# EAGLE design Orange Board (EAGLE 8.4.3)

## Sheet 1 of 3
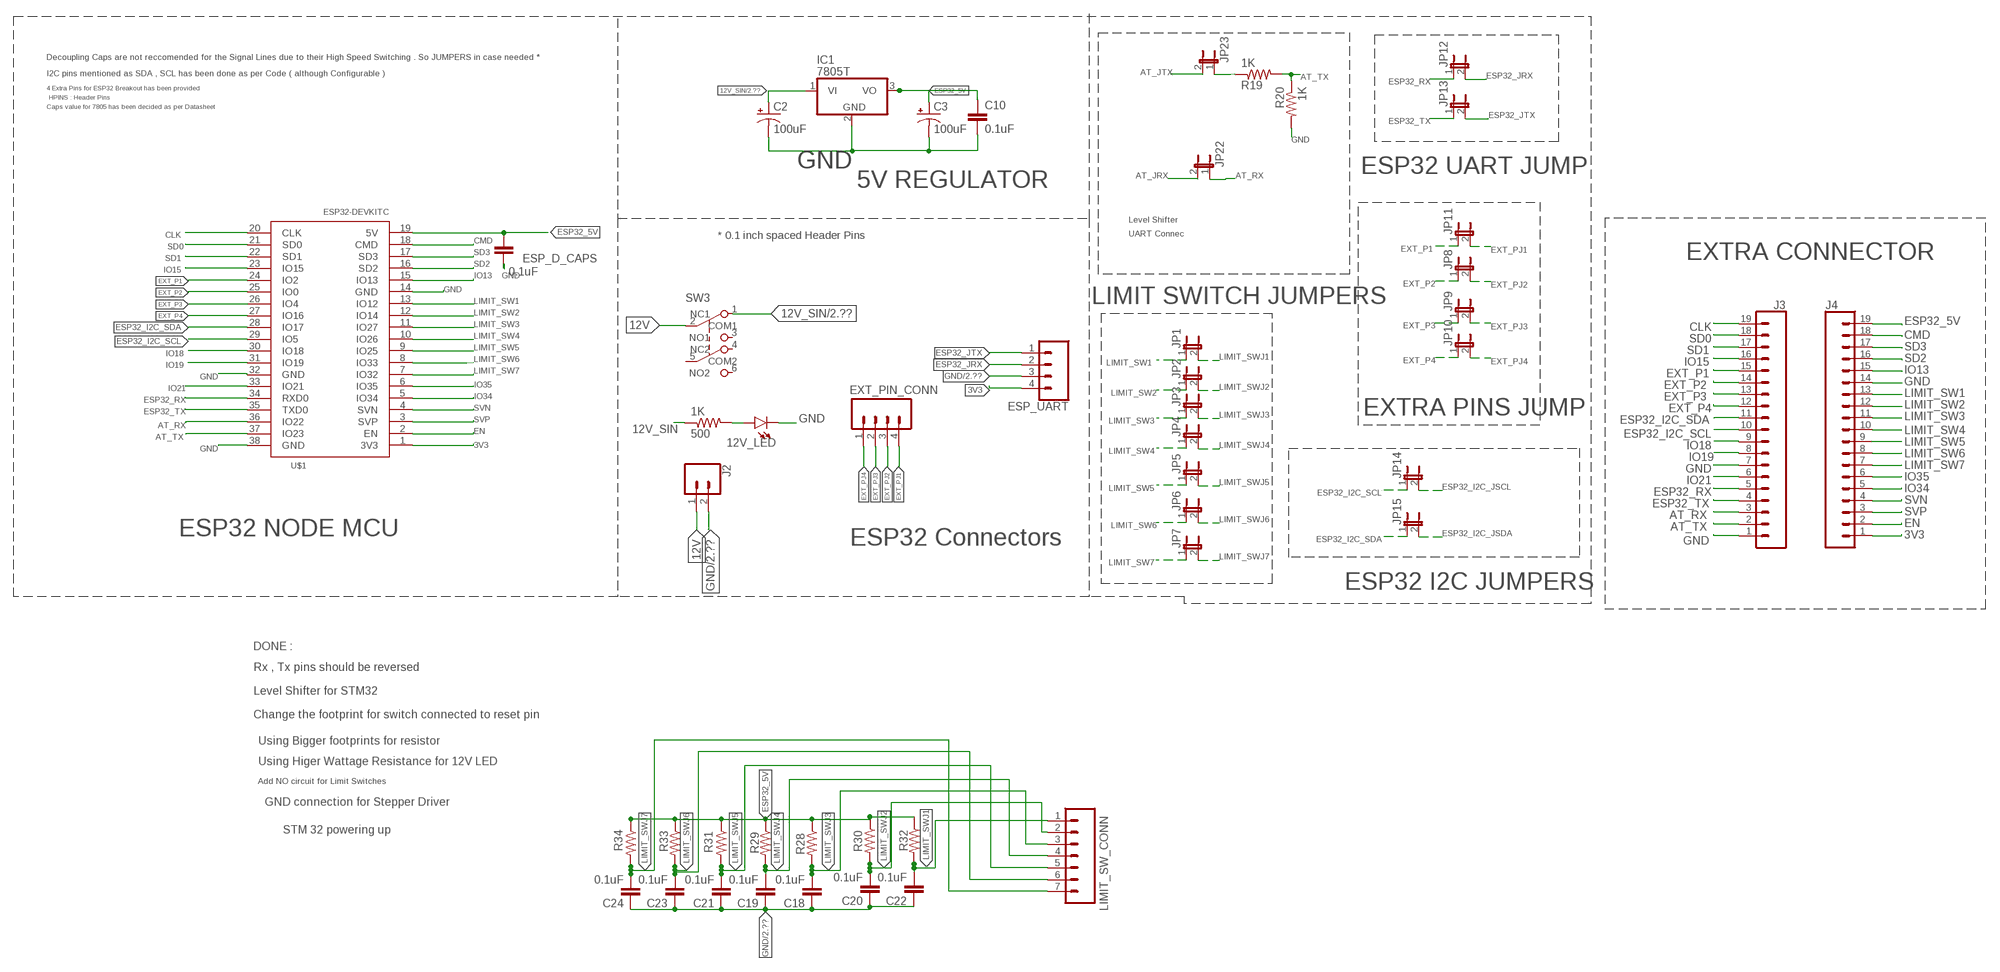
[diagram p0: schematic, sheet 1]

### Parts
12V_LED  LED-3MM-NO_SILK  [LED_3MM-NS]
500  1K  R-US_0207/15  [0207/15]
C2  100uF  100UF-POLAR-RADIAL-2.5MM-25V-20%  [CPOL-RADIAL-2.5MM-6.5MM]
C3  100uF  100UF-POLAR-RADIAL-2.5MM-25V-20%  [CPOL-RADIAL-2.5MM-6.5MM]
C10  0.1uF  0.1UF-KIT-EZ-50V-20%  [CAP-PTH-SMALL-KIT]
C18  0.1uF  0.1UF-KIT-EZ-50V-20%  [CAP-PTH-SMALL-KIT]
C19  0.1uF  0.1UF-KIT-EZ-50V-20%  [CAP-PTH-SMALL-KIT]
C20  0.1uF  0.1UF-KIT-EZ-50V-20%  [CAP-PTH-SMALL-KIT]
C21  0.1uF  0.1UF-KIT-EZ-50V-20%  [CAP-PTH-SMALL-KIT]
C22  0.1uF  0.1UF-KIT-EZ-50V-20%  [CAP-PTH-SMALL-KIT]
C23  0.1uF  0.1UF-KIT-EZ-50V-20%  [CAP-PTH-SMALL-KIT]
C24  0.1uF  0.1UF-KIT-EZ-50V-20%  [CAP-PTH-SMALL-KIT]
ESP_D_CAPS  0.1uF  0.1UF-KIT-EZ-50V-20%  [CAP-PTH-SMALL-KIT]
ESP_UART  CONN_04  [1X04]
EXT_PIN_CONN  CONN_04  [1X04]
IC1  7805T  [TO220H]
J2  CONN_025MM  [SCREWTERMINAL-5MM-2]
J3  CONN_19  [1X19]
J4  CONN_19  [1X19]
JP1  JUMPER-2PTH  [1X02]
JP2  JUMPER-2PTH  [1X02]
JP3  JUMPER-2PTH  [1X02]
JP4  JUMPER-2PTH  [1X02]
JP5  JUMPER-2PTH  [1X02]
JP6  JUMPER-2PTH  [1X02]
JP7  JUMPER-2PTH  [1X02]
JP8  JUMPER-2PTH  [1X02]
JP9  JUMPER-2PTH  [1X02]
JP10  JUMPER-2PTH  [1X02]
JP11  JUMPER-2PTH  [1X02]
JP12  JUMPER-2PTH  [1X02]
JP13  JUMPER-2PTH  [1X02]
JP14  JUMPER-2PTH  [1X02]
JP15  JUMPER-2PTH  [1X02]
JP22  JUMPER-2PTH  [1X02]
JP23  JUMPER-2PTH  [1X02]
LIMIT_SW_CONN  CONN_07  [1X07]
R19  1K  R-US_0207/10  [0207/10]
R20  1K  R-US_0207/10  [0207/10]
R28  R-US_0207/10  [0207/10]
R29  R-US_0207/10  [0207/10]
R30  R-US_0207/10  [0207/10]
R31  R-US_0207/10  [0207/10]
R32  R-US_0207/10  [0207/10]
R33  R-US_0207/10  [0207/10]
R34  R-US_0207/10  [0207/10]
SW3  SW_PUSH_DPDT  [SW_PUSH_BUTTON_MINI]
U$1  ESP32DEVKITC  [ESP32-DEVKITC]

### Nets
3V3: ESP_UART.4 J4.1 U$1.1(3V3)
12V: J2.1 SW3.2(COM1)
12V_SIN: 500.1 C2.1(+) IC1.1(VI) SW3.1(NC1) ; also sheet 2,3
AT_JRX: JP22.2 ; also sheet 3
AT_JTX: JP23.2 ; also sheet 3
AT_RX: J3.3 JP22.1 U$1.36(IO22)
AT_TX: J3.2 R19.2 R20.1 U$1.37(IO23)
CLK: J3.19 U$1.20(CLK)
CMD: J4.18 U$1.18(CMD)
EN: J4.2 U$1.2(EN)
ESP32_5V: C3.1(+) C10.1 ESP_D_CAPS.1 IC1.3(VO) J4.19 R28.1 R29.1 R30.1 R31.1 R32.1 R33.1 R34.1 U$1.19(5V)
ESP32_I2C_JSCL: JP14.2 ; also sheet 2
ESP32_I2C_JSDA: JP15.2 ; also sheet 2
ESP32_I2C_SCL: J3.10 JP14.1 U$1.29(IO5)
ESP32_I2C_SDA: J3.11 JP15.1 U$1.28(IO17)
ESP32_JRX: ESP_UART.2 JP12.2
ESP32_JTX: ESP_UART.1 JP13.2
ESP32_RX: J3.5 JP12.1 U$1.34(RXD0)
ESP32_TX: J3.4 JP13.1 U$1.35(TXD0)
EXT_P1: J3.15 JP11.1 U$1.24(IO2)
EXT_P2: J3.14 JP8.1 U$1.25(IO0)
EXT_P3: J3.13 JP9.1 U$1.26(IO4)
EXT_P4: J3.12 JP10.1 U$1.27(IO16)
EXT_PJ1: EXT_PIN_CONN.4 JP11.2
EXT_PJ2: EXT_PIN_CONN.3 JP8.2
EXT_PJ3: EXT_PIN_CONN.2 JP9.2
EXT_PJ4: EXT_PIN_CONN.1 JP10.2
GND: 12V_LED.K(C) C2.2(-) C3.2(-) C10.2 C18.1 C19.1 C20.1 C21.1 C22.1 C23.1 C24.1 ESP_D_CAPS.2 ESP_UART.3 IC1.2(GND) J2.2 J3.1 J3.7 J4.14 R20.2 U$1.14(GND) U$1.32(GND) U$1.38(GND) ; also sheet 2,3
IO13: J4.15 U$1.15(IO13)
IO15: J3.16 U$1.23(IO15)
IO18: J3.9 U$1.30(IO18)
IO19: J3.8 U$1.31(IO19)
IO21: J3.6 U$1.33(IO21)
IO34: J4.5 U$1.5(IO34)
IO35: J4.6 U$1.6(IO35)
LIMIT_SW1: J4.13 JP1.1 U$1.13(IO12)
LIMIT_SW2: J4.12 JP2.1 U$1.12(IO14)
LIMIT_SW3: J4.11 JP3.1 U$1.11(IO27)
LIMIT_SW4: J4.10 JP4.1 U$1.10(IO26)
LIMIT_SW5: J4.9 JP5.1 U$1.9(IO25)
LIMIT_SW6: J4.8 JP6.1 U$1.8(IO33)
LIMIT_SW7: J4.7 JP7.1 U$1.7(IO32)
LIMIT_SWJ1: C22.2 JP1.2 LIMIT_SW_CONN.1 R32.2
LIMIT_SWJ2: C20.2 JP2.2 LIMIT_SW_CONN.2 R30.2
LIMIT_SWJ3: C18.2 JP3.2 LIMIT_SW_CONN.3 R28.2
LIMIT_SWJ4: C19.2 JP4.2 LIMIT_SW_CONN.4 R29.2
LIMIT_SWJ5: C21.2 JP5.2 LIMIT_SW_CONN.5 R31.2
LIMIT_SWJ6: C23.2 JP6.2 LIMIT_SW_CONN.6 R33.2
LIMIT_SWJ7: C24.2 JP7.2 LIMIT_SW_CONN.7 R34.2
N$16: JP23.1 R19.1
N$22: 12V_LED.A 500.2
SD0: J3.18 U$1.21(SD0)
SD1: J3.17 U$1.22(SD1)
SD2: J4.16 U$1.16(SD2)
SD3: J4.17 U$1.17(SD3)
SVN: J4.4 U$1.4(SVN)
SVP: J4.3 U$1.3(SVP)
Unconnected: SW3.3(NO1) SW3.4(NC2) SW3.5(COM2) SW3.6(NO2)

### Notes on the sheet
- Decoupling Caps are not reccomended for the Signal Lines due to their High Speed Switching . So JUMPERS in case needed *
- I2C pins mentioned as SDA , SCL has been done as per Code ( although Configurable )
- 4 Extra Pins for ESP32 Breakout has been provided
- HPINS : Header Pins
- Caps value for 7805 has been decided as per Datasheet
- ESP32 UART JUMP
- 5V REGULATOR
- Level Shifter
- * 0.1 inch spaced Header Pins | UART Connec
- EXTRA CONNECTOR
- LIMIT SWITCH JUMPERS
- EXTRA PINS JUMP
- ESP32 NODE MCU
- ESP32 Connectors
- ESP32 I2C JUMPERS
- DONE :
- Rx , Tx pins should be reversed
- Level Shifter for STM32
- Change the footprint for switch connected to reset pin
- Using Bigger footprints for resistor
- Using Higer Wattage Resistance for 12V LED
- Add NO circuit for Limit Switches
- GND connection for Stepper Driver
- STM 32 powering up

## Sheet 2 of 3
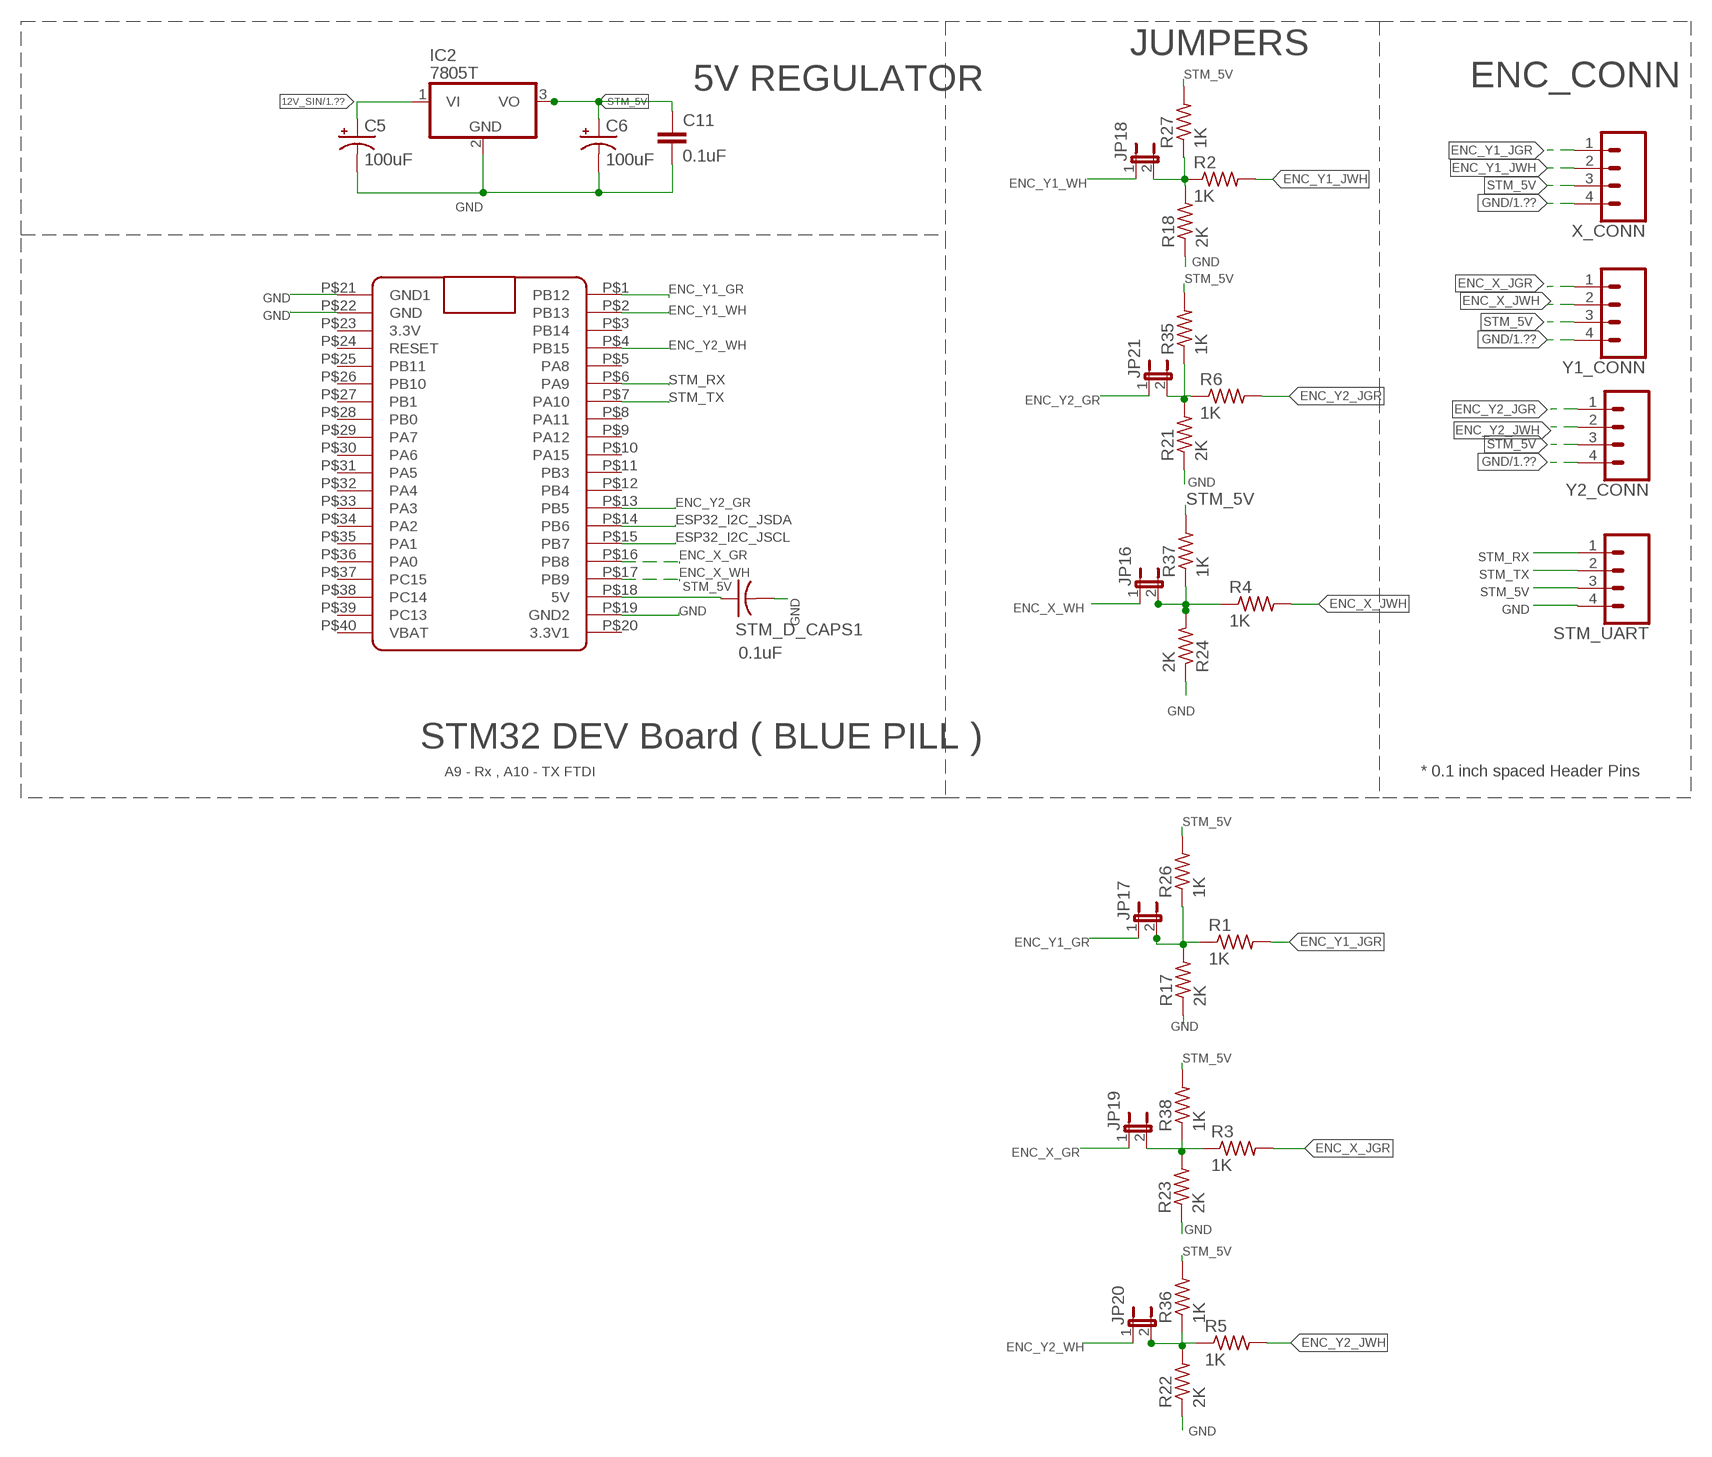
[diagram p1: schematic, sheet 2]

### Parts
C5  100uF  100UF-POLAR-RADIAL-2.5MM-25V-20%  [CPOL-RADIAL-2.5MM-6.5MM]
C6  100uF  100UF-POLAR-RADIAL-2.5MM-25V-20%  [CPOL-RADIAL-2.5MM-6.5MM]
C11  0.1uF  0.1UF-KIT-EZ-50V-20%  [CAP-PTH-SMALL-KIT]
IC2  7805T  [TO220H]
JP16  JUMPER-2PTH  [1X02]
JP17  JUMPER-2PTH  [1X02]
JP18  JUMPER-2PTH  [1X02]
JP19  JUMPER-2PTH  [1X02]
JP20  JUMPER-2PTH  [1X02]
JP21  JUMPER-2PTH  [1X02]
R1  1K  R-US_0207/10  [0207/10]
R2  1K  R-US_0207/10  [0207/10]
R3  1K  R-US_0207/10  [0207/10]
R4  1K  R-US_0207/10  [0207/10]
R5  1K  R-US_0207/10  [0207/10]
R6  1K  R-US_0207/10  [0207/10]
R17  2K  R-US_0207/10  [0207/10]
R18  2K  R-US_0207/10  [0207/10]
R21  2K  R-US_0207/10  [0207/10]
R22  2K  R-US_0207/10  [0207/10]
R23  2K  R-US_0207/10  [0207/10]
R24  2K  R-US_0207/10  [0207/10]
R26  1K  R-US_0207/10  [0207/10]
R27  1K  R-US_0207/10  [0207/10]
R35  1K  R-US_0207/10  [0207/10]
R36  1K  R-US_0207/10  [0207/10]
R37  1K  R-US_0207/10  [0207/10]
R38  1K  R-US_0207/10  [0207/10]
STM_D_CAPS1  0.1uF  C-US025-024X044  [C025-024X044]
STM_UART  CONN_04  [1X04]
U$2  BLUE_PILLADVANCED  [BLUE_PILL_ADV]
X_CONN  CONN_04  [1X04]
Y1_CONN  CONN_04  [1X04]
Y2_CONN  CONN_04  [1X04]

### Nets
12V_SIN: C5.1(+) IC2.1(VI) ; also sheet 1,3
ENC_X_GR: JP19.1 U$2.P$16(PB8)
ENC_X_JGR: R3.2 Y1_CONN.1
ENC_X_JWH: R4.2 Y1_CONN.2
ENC_X_WH: JP16.1 U$2.P$17(PB9)
ENC_Y1_GR: JP17.1 U$2.P$1(PB12)
ENC_Y1_JGR: R1.2 X_CONN.1
ENC_Y1_JWH: R2.2 X_CONN.2
ENC_Y1_WH: JP18.1 U$2.P$2(PB13)
ENC_Y2_GR: JP21.1 U$2.P$13(PB5)
ENC_Y2_JGR: R6.2 Y2_CONN.1
ENC_Y2_JWH: R5.2 Y2_CONN.2
ENC_Y2_WH: JP20.1 U$2.P$4(PB15)
ESP32_I2C_JSCL: U$2.P$15(PB7) ; also sheet 1
ESP32_I2C_JSDA: U$2.P$14(PB6) ; also sheet 1
GND: C5.2(-) C6.2(-) C11.2 IC2.2(GND) R17.1 R18.1 R21.1 R22.1 R23.1 R24.1 STM_D_CAPS1.2 STM_UART.4 U$2.P$19(GND2) U$2.P$21(GND1) U$2.P$22(GND) X_CONN.4 Y1_CONN.4 Y2_CONN.4 ; also sheet 1,3
N$4: JP17.2 R1.1 R17.2 R26.1
N$14: JP19.2 R3.1 R23.2 R38.1
N$15: JP16.2 R4.1 R24.2 R37.1
N$17: JP18.2 R2.1 R18.2 R27.1
N$18: JP21.2 R6.1 R21.2 R35.1
N$20: JP20.2 R5.1 R22.2 R36.1
STM_5V: C6.1(+) C11.1 IC2.3(VO) R26.2 R27.2 R35.2 R36.2 R37.2 R38.2 STM_D_CAPS1.1 STM_UART.3 U$2.P$18(5V) X_CONN.3 Y1_CONN.3 Y2_CONN.3
STM_RX: STM_UART.1 U$2.P$6(PA9)
STM_TX: STM_UART.2 U$2.P$7(PA10)
Unconnected: U$2.P$3(PB14) U$2.P$5(PA8) U$2.P$8(PA11) U$2.P$9(PA12) U$2.P$10(PA15) U$2.P$11(PB3) U$2.P$12(PB4) U$2.P$20(3.3V1) U$2.P$23(3.3V) U$2.P$24(RESET) U$2.P$25(PB11) U$2.P$26(PB10) U$2.P$27(PB1) U$2.P$28(PB0) U$2.P$29(PA7) U$2.P$30(PA6) U$2.P$31(PA5) U$2.P$32(PA4) U$2.P$33(PA3) U$2.P$34(PA2) U$2.P$35(PA1) U$2.P$36(PA0) U$2.P$37(PC15) U$2.P$38(PC14) U$2.P$39(PC13) U$2.P$40(VBAT)

### Notes on the sheet
- JUMPERS
- 5V REGULATOR | ENC_CONN
- STM32 DEV Board ( BLUE PILL )
- A9 - Rx , A10 - TX FTDI | * 0.1 inch spaced Header Pins

## Sheet 3 of 3
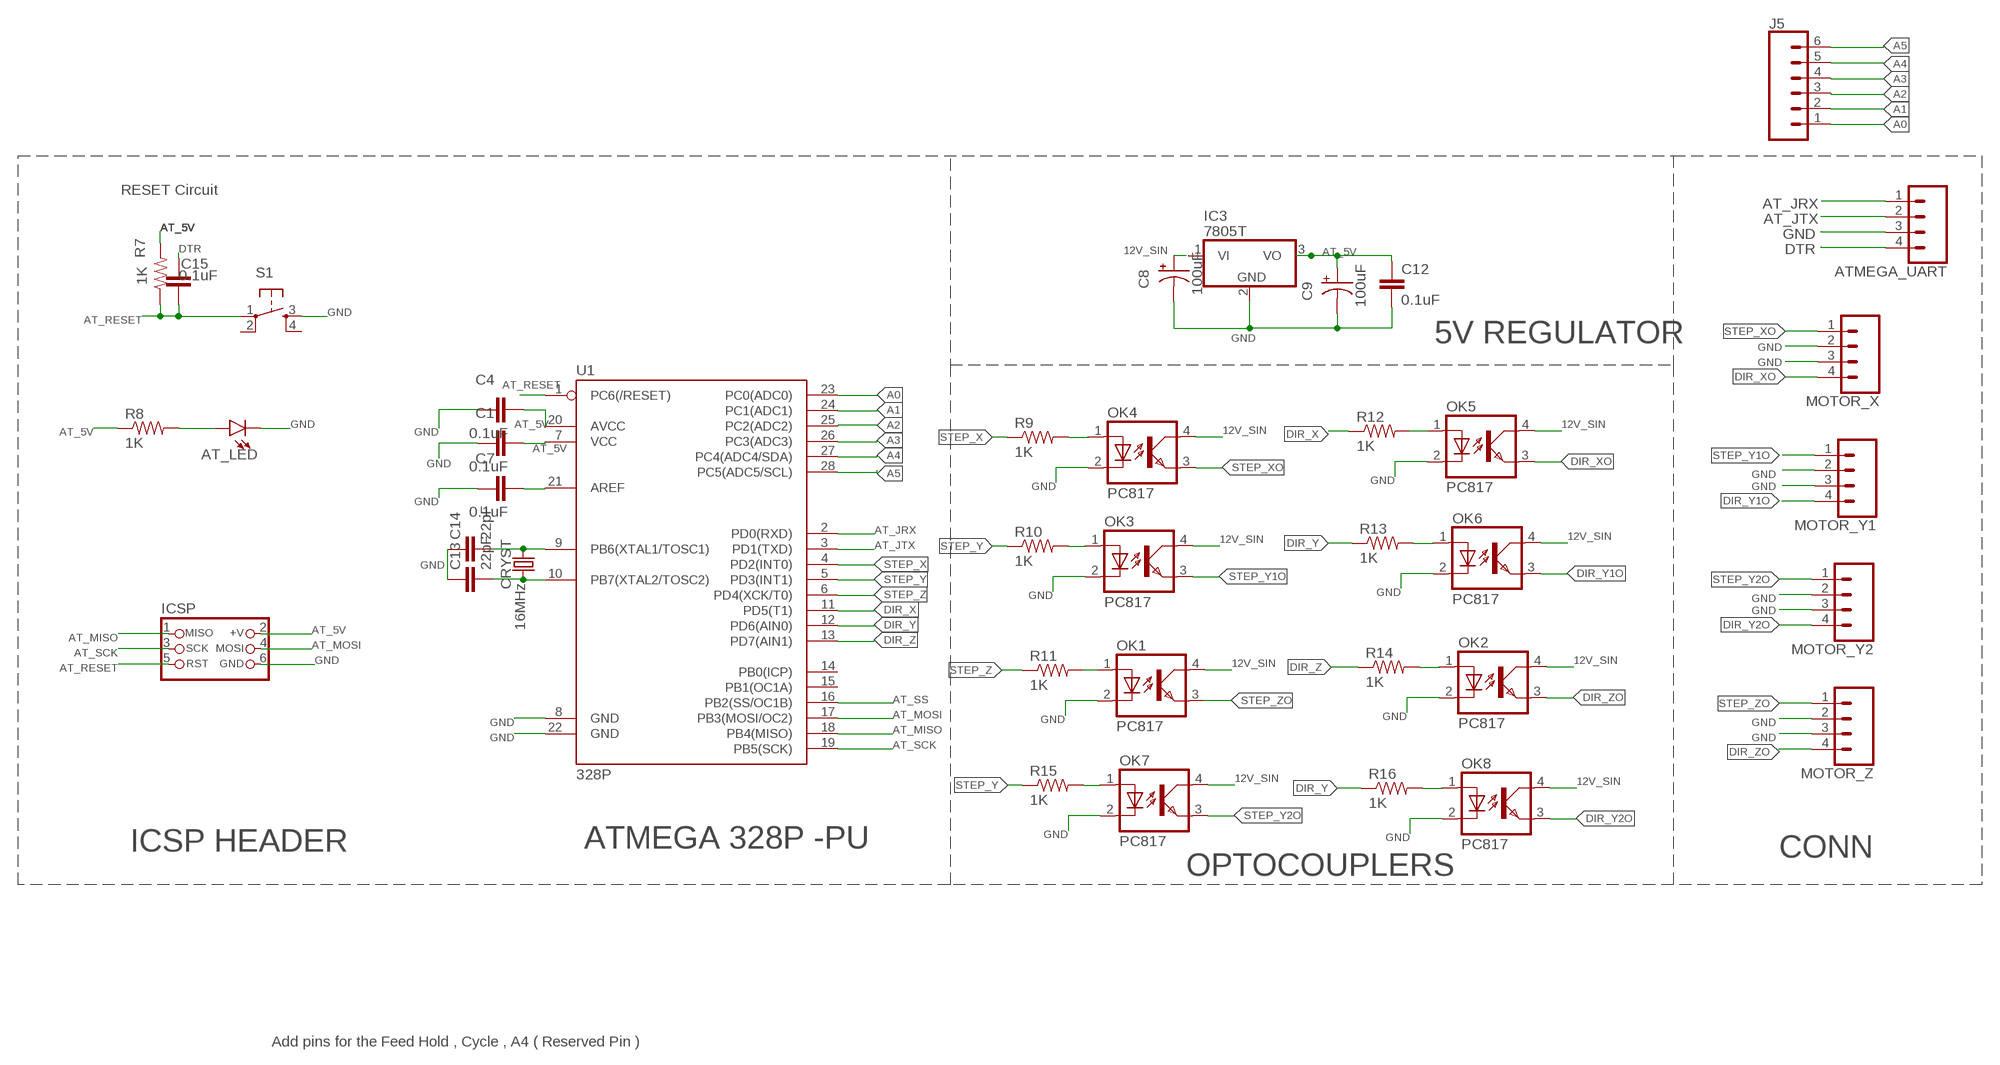
[diagram p2: schematic, sheet 3]

### Parts
AT_LED  LED-3MM-NO_SILK  [LED_3MM-NS]
ATMEGA_UART  CONN_04  [1X04]
C1  0.1uF  0.1UF-KIT-EZ-50V-20%  [CAP-PTH-SMALL-KIT]
C4  0.1uF  0.1UF-KIT-EZ-50V-20%  [CAP-PTH-SMALL-KIT]
C7  0.1uF  0.1UF-KIT-EZ-50V-20%  [CAP-PTH-SMALL-KIT]
C8  100uF  100UF-POLAR-RADIAL-2.5MM-25V-20%  [CPOL-RADIAL-2.5MM-6.5MM]
C9  100uF  100UF-POLAR-RADIAL-2.5MM-25V-20%  [CPOL-RADIAL-2.5MM-6.5MM]
C12  0.1uF  0.1UF-KIT-EZ-50V-20%  [CAP-PTH-SMALL-KIT]
C13  22pF  22PF-PTH-2.54MM-200V-5%  [CAP-PTH-2.54]
C14  22pF  22PF-PTH-2.54MM-200V-5%  [CAP-PTH-2.54]
C15  0.1uF  0.1UF-KIT-EZ-50V-20%  [CAP-PTH-SMALL-KIT]
CRYST  16MHz  CRYSTAL-16MHZPTH-HC49US  [HC49US]
IC3  7805T  [TO220H]
ICSP  CON_HEADER_PRG_AVR_ICSP-PTH  [HEADER_PRG_2X03]
J5  CONN_06NO_SILK_FEMALE_PTH  [1X06_NO_SILK]
MOTOR_X  CONN_04  [1X04]
MOTOR_Y1  CONN_04  [1X04]
MOTOR_Y2  CONN_04  [1X04]
MOTOR_Z  CONN_04  [1X04]
OK1  PC817  [DIL04]
OK2  PC817  [DIL04]
OK3  PC817  [DIL04]
OK4  PC817  [DIL04]
OK5  PC817  [DIL04]
OK6  PC817  [DIL04]
OK7  PC817  [DIL04]
OK8  PC817  [DIL04]
R7  1K  R-US_0207/10  [0207/10]
R8  1K  R-US_0207/10  [0207/10]
R9  1K  R-US_0207/10  [0207/10]
R10  1K  R-US_0207/10  [0207/10]
R11  1K  R-US_0207/10  [0207/10]
R12  1K  R-US_0207/10  [0207/10]
R13  1K  R-US_0207/10  [0207/10]
R14  1K  R-US_0207/10  [0207/10]
R15  1K  R-US_0207/10  [0207/10]
R16  1K  R-US_0207/10  [0207/10]
S1  TAC_SWITCHPTH  [TACTILE-PTH]
U1  328P  ATMEGA328P_PDIP  [DIP28]

### Nets
12V_SIN: C8.1(+) IC3.1(VI) OK1.4(COL) OK2.4(COL) OK3.4(COL) OK4.4(COL) OK5.4(COL) OK6.4(COL) OK7.4(COL) OK8.4(COL) ; also sheet 1,2
A0: J5.1 U1.23(PC0(ADC0))
A1: J5.2 U1.24(PC1(ADC1))
A2: J5.3 U1.25(PC2(ADC2))
A3: J5.4 U1.26(PC3(ADC3))
A4: J5.5 U1.27(PC4(ADC4/SDA))
A5: J5.6 U1.28(PC5(ADC5/SCL))
AT_5V: C1.1 C4.1 C9.1(+) C12.1 IC3.3(VO) ICSP.2(+V) R7.2 R8.1 U1.7(VCC) U1.20(AVCC)
AT_JRX: ATMEGA_UART.1 U1.2(PD0(RXD)) ; also sheet 1
AT_JTX: ATMEGA_UART.2 U1.3(PD1(TXD)) ; also sheet 1
AT_MISO: ICSP.1(MISO) U1.18(PB4(MISO))
AT_MOSI: ICSP.4(MOSI) U1.17(PB3(MOSI/OC2))
AT_RESET: C15.1 ICSP.5(RST) R7.1 S1.1 U1.1(PC6(/RESET))
AT_SCK: ICSP.3(SCK) U1.19(PB5(SCK))
AT_SS: U1.16(PB2(SS/OC1B))
DIR_X: R12.1 U1.11(PD5(T1))
DIR_XO: MOTOR_X.4 OK5.3(EMIT)
DIR_Y: R13.1 R16.1 U1.12(PD6(AIN0))
DIR_Y1O: MOTOR_Y1.4 OK6.3(EMIT)
DIR_Y2O: MOTOR_Y2.4 OK8.3(EMIT)
DIR_Z: R14.1 U1.13(PD7(AIN1))
DIR_ZO: MOTOR_Z.4 OK2.3(EMIT)
DTR: ATMEGA_UART.4 C15.2
GND: AT_LED.K(C) ATMEGA_UART.3 C1.2 C4.2 C7.2 C8.2(-) C9.2(-) C12.2 C13.1 C14.1 IC3.2(GND) ICSP.6(GND) MOTOR_X.2 MOTOR_X.3 MOTOR_Y1.2 MOTOR_Y1.3 MOTOR_Y2.2 MOTOR_Y2.3 MOTOR_Z.2 MOTOR_Z.3 OK1.2(C) OK2.2(C) OK3.2(C) OK4.2(C) OK5.2(C) OK6.2(C) OK7.2(C) OK8.2(C) S1.3 U1.8(GND) U1.22(GND) ; also sheet 1,2
N$1: C13.2 CRYST.1 U1.10(PB7(XTAL2/TOSC2))
N$2: C14.2 CRYST.2 U1.9(PB6(XTAL1/TOSC1))
N$3: AT_LED.A R8.2
N$5: C7.1 U1.21(AREF)
N$6: OK4.1(A) R9.2
N$7: OK3.1(A) R10.2
N$8: OK1.1(A) R11.2
N$9: OK5.1(A) R12.2
N$10: OK2.1(A) R14.2
N$11: OK6.1(A) R13.2
N$12: OK7.1(A) R15.2
N$13: OK8.1(A) R16.2
STEP_X: R9.1 U1.4(PD2(INT0))
STEP_XO: MOTOR_X.1 OK4.3(EMIT)
STEP_Y: R10.1 R15.1 U1.5(PD3(INT1))
STEP_Y1O: MOTOR_Y1.1 OK3.3(EMIT)
STEP_Y2O: MOTOR_Y2.1 OK7.3(EMIT)
STEP_Z: R11.1 U1.6(PD4(XCK/T0))
STEP_ZO: MOTOR_Z.1 OK1.3(EMIT)
Unconnected: S1.2 S1.4 U1.14(PB0(ICP)) U1.15(PB1(OC1A))

### Notes on the sheet
- RESET Circuit
- 5V REGULATOR
- ICSP HEADER | ATMEGA 328P -PU | CONN
- OPTOCOUPLERS
- Add pins for the Feed Hold , Cycle , A4 ( Reserved Pin )

## Library data of the parts
12V_LED AT_LED = SparkFun-LED:LED: LED (Generic) Standard schematic elements and footprints for 5mm, 3mm, 1206, and 0603 sized LEDs. Generic LEDs with no color specified.
500 R1-R24 R26-R38 = resistor:R-US_: RESISTOR, American symbol
ATMEGA_UART ESP_UART EXT_PIN_CONN MOTOR_X MOTOR_Y1 MOTOR_Y2 MOTOR_Z STM_UART X_CONN Y1_CONN Y2_CONN = SparkFun-Connectors:CONN_04: Multi connection point. Often used as Generic Header-pin footprint for 0.1 inch spaced/style header connections On any of the 0.1 inch spaced packages, you can populate with these: Break Away Headers - Straight <https://www.sparkfun.com/products/116> (PRT-00116) Break Away Male Headers - Right Angle <https://www.sparkfun.com/products/553> (PRT-00553) Female Headers <https://www.sparkfun.com/products/115> (PRT-00115) Break Away Headers - Machine Pin <https://www.sparkfun.com/products/117> (PRT-00117) Break Away Female Headers - Swiss Machine Pin <https://www.sparkfun.com/products/743> (PRT-00743) For SCREWTERMINALS and SPRING TERMINALS visit here: Screw Terimnals on SparkFun.com <https://www.sparkfun.com/search/results?term=Screw+Terminals> (5mm/3.5mm/2.54mm spacing) This device is also useful as a general connection point to wire up your design to another part of your project. Our various solder wires solder well into these plated through hole pads. Hook-Up Wire - Assortment (Stranded, 22 AWG) <https://www.sparkfun.com/products/11375> (PRT-11375) Hook-Up Wire - Assortment (Solid Core, 22 AWG) <https://www.sparkfun.com/products/11367> (PRT-11367) View the entire wire category on our website here <https://www.sparkfun.com/categories/141> Special notes: Molex polarized connector foot print use with SKU : PRT-08231 with associated crimp pins and housings. 1MM SMD Version SKU: PRT-10208; PROD_ID: CONN-09696
C1 C4 C7 C10-C12 C15 C18-C24 ESP_D_CAPS = SparkFun-Capacitors:0.1UF: 0.1µF ceramic capacitors A capacitor is a passive two-terminal electrical component used to store electrical energy temporarily in an electric field.; PROD_ID: CAP-08370
C2 C3 C5 C6 C8 C9 = SparkFun-Capacitors:100UF-POLAR: 100µF polarized capacitors A capacitor is a passive two-terminal electrical component used to store electrical energy temporarily in an electric field.; PROD_ID: CAP-08439
C13 C14 = SparkFun-Capacitors:22PF: 22pF ceramic capacitors A capacitor is a passive two-terminal electrical component used to store electrical energy temporarily in an electric field.; PROD_ID: CAP-09128
CRYST = SparkFun-Clocks:CRYSTAL-16MHZ: 16MHz Crystal Digikey Example <http://www.digikey.com/product-search/en?keywords=535-9122-1-ND> Frequency: 16MHz Frequency Stability: ±50ppm Frequency Tolerance: ±20ppm Load Capacitance: 18pF SparkFun Products: Pro Micro -5V/16MHz <https://www.sparkfun.com/products/12640> SparkFun Serial Enabled LCD Kit <https://www.sparkfun.com/products/10097>; PROD_ID: XTAL-08181; SF_ID: COM-00536
IC1-IC3 = adafruit:78*: Positive VOLTAGE REGULATOR Added bigger pads to the TO-92 package
ICSP = dp_devices:CON_HEADER_PRG_AVR_ICSP: 2x3 AVR ICSP programming header
J2 = SparkFun-Connectors:CONN_02: Multi connection point. Often used as Generic Header-pin footprint for 0.1 inch spaced/style header connections On any of the 0.1 inch spaced packages, you can populate with these: Break Away Headers - Straight <https://www.sparkfun.com/products/116> (PRT-00116) Break Away Male Headers - Right Angle <https://www.sparkfun.com/products/553> (PRT-00553) Female Headers <https://www.sparkfun.com/products/115> (PRT-00115) Break Away Headers - Machine Pin <https://www.sparkfun.com/products/117> (PRT-00117) Break Away Female Headers - Swiss Machine Pin <https://www.sparkfun.com/products/743> (PRT-00743) For SCREWTERMINALS and SPRING TERMINALS visit here: Screw Terimnals on SparkFun.com <https://www.sparkfun.com/search/results?term=Screw+Terminals> (5mm/3.5mm/2.54mm spacing) This device is also useful as a general connection point to wire up your design to another part of your project. Our various solder wires solder well into these plated through hole pads. Hook-Up Wire - Assortment (Stranded, 22 AWG) <https://www.sparkfun.com/products/11375> (PRT-11375) Hook-Up Wire - Assortment (Solid Core, 22 AWG) <https://www.sparkfun.com/products/11367> (PRT-11367) View the entire wire category on our website here <https://www.sparkfun.com/categories/141> Special notes: Molex polarized connector foot print use with: PRT-08233 with associated crimp pins and housings. 2.54_SCREWTERM for use with PRT-10571. 3.5mm Screw Terminal footprints for PRT-08084 5mm Screw Terminal footprints for use with PRT-08432; SF_SKU: PRT-08432
J3 J4 = SparkFun-Connectors:CONN_19: Multi connection point. Often used as Generic Header-pin footprint for 0.1 inch spaced/style header connections On any of the 0.1 inch spaced packages, you can populate with these: Break Away Headers - Straight <https://www.sparkfun.com/products/116> (PRT-00116) Break Away Male Headers - Right Angle <https://www.sparkfun.com/products/553> (PRT-00553) Female Headers <https://www.sparkfun.com/products/115> (PRT-00115) Break Away Headers - Machine Pin <https://www.sparkfun.com/products/117> (PRT-00117) Break Away Female Headers - Swiss Machine Pin <https://www.sparkfun.com/products/743> (PRT-00743) For SCREWTERMINALS and SPRING TERMINALS visit here: Screw Terimnals on SparkFun.com <https://www.sparkfun.com/search/results?term=Screw+Terminals> (5mm/3.5mm/2.54mm spacing) This device is also useful as a general connection point to wire up your design to another part of your project. Our various solder wires solder well into these plated through hole pads. Hook-Up Wire - Assortment (Stranded, 22 AWG) <https://www.sparkfun.com/products/11375> (PRT-11375) Hook-Up Wire - Assortment (Solid Core, 22 AWG) <https://www.sparkfun.com/products/11367> (PRT-11367) View the entire wire category on our website here <https://www.sparkfun.com/categories/141> Special notes: Molex polarized connector foot print use with SKU : PRT-08231 with associated crimp pins and housings. 1MM SMD Version SKU: PRT-10208 NOTES ON THE VARIANTS LOCK and LOCK_LONGPADS... This footprint was designed to help hold the alignment of a through-hole component (i.e. 6-pin header) while soldering it into place. You may notice that each hole has been shifted either up or down by 0.005 of an inch from it's more standard position (which is a perfectly straight line). This slight alteration caused the pins (the squares in the middle) to touch the edges of the holes. Because they are alternating, it causes a "brace" to hold the component in place. 0.005 has proven to be the perfect amount of "off-center" position when using our standard breakaway headers. Although looks a little odd when you look at the bare footprint, once you have a header in there, the alteration is very hard to notice. Also,if you push a header all the way into place, it is covered up entirely on the bottom side.
J5 = SparkFun-Connectors:CONN_06: Multi connection point. Often used as Generic Header-pin footprint for 0.1 inch spaced/style header connections On any of the 0.1 inch spaced packages, you can populate with these: Break Away Headers - Straight <https://www.sparkfun.com/products/116> (PRT-00116) Break Away Male Headers - Right Angle <https://www.sparkfun.com/products/553> (PRT-00553) Female Headers <https://www.sparkfun.com/products/115> (PRT-00115) Break Away Headers - Machine Pin <https://www.sparkfun.com/products/117> (PRT-00117) Break Away Female Headers - Swiss Machine Pin <https://www.sparkfun.com/products/743> (PRT-00743) Arduino Stackable Header - 6 Pin <https://www.sparkfun.com/products/9280> (PRT-09280) For SCREWTERMINALS and SPRING TERMINALS visit here: Screw Terimnals on SparkFun.com <https://www.sparkfun.com/search/results?term=Screw+Terminals> (5mm/3.5mm/2.54mm spacing) This device is also useful as a general connection point to wire up your design to another part of your project. Our various solder wires solder well into these plated through hole pads. Hook-Up Wire - Assortment (Stranded, 22 AWG) <https://www.sparkfun.com/products/11375> (PRT-11375) Hook-Up Wire - Assortment (Solid Core, 22 AWG) <https://www.sparkfun.com/products/11367> (PRT-11367) View the entire wire category on our website here <https://www.sparkfun.com/categories/141>; PROD_ID: CONN-08437
JP1-JP23 = SparkFun-Retired:JUMPER-2: Jumper Basic 0.1" spaced jumper. Use with breakaway headers.
LIMIT_SW_CONN = SparkFun-Connectors:CONN_07: Multi connection point. Often used as Generic Header-pin footprint for 0.1 inch spaced/style header connections On any of the 0.1 inch spaced packages, you can populate with these: Break Away Headers - Straight <https://www.sparkfun.com/products/116> (PRT-00116) Break Away Male Headers - Right Angle <https://www.sparkfun.com/products/553> (PRT-00553) Female Headers <https://www.sparkfun.com/products/115> (PRT-00115) Break Away Headers - Machine Pin <https://www.sparkfun.com/products/117> (PRT-00117) Break Away Female Headers - Swiss Machine Pin <https://www.sparkfun.com/products/743> (PRT-00743) For SCREWTERMINALS and SPRING TERMINALS visit here: Screw Terimnals on SparkFun.com <https://www.sparkfun.com/search/results?term=Screw+Terminals> (5mm/3.5mm/2.54mm spacing) This device is also useful as a general connection point to wire up your design to another part of your project. Our various solder wires solder well into these plated through hole pads. Hook-Up Wire - Assortment (Stranded, 22 AWG) <https://www.sparkfun.com/products/11375> (PRT-11375) Hook-Up Wire - Assortment (Solid Core, 22 AWG) <https://www.sparkfun.com/products/11367> (PRT-11367) View the entire wire category on our website here <https://www.sparkfun.com/categories/141> Special notes: Molex polarized connector foot print use with SKU : PRT-08231 with associated crimp pins and housings. 1MM SMD Version SKU: PRT-10208 NOTES ON THE VARIANTS LOCK and LOCK_LONGPADS... This footprint was designed to help hold the alignment of a through-hole component (i.e. 6-pin header) while soldering it into place. You may notice that each hole has been shifted either up or down by 0.005 of an inch from it's more standard position (which is a perfectly straight line). This slight alteration caused the pins (the squares in the middle) to touch the edges of the holes. Because they are alternating, it causes a "brace" to hold the component in place. 0.005 has proven to be the perfect amount of "off-center" position when using our standard breakaway headers. Although looks a little odd when you look at the bare footprint, once you have a header in there, the alteration is very hard to notice. Also,if you push a header all the way into place, it is covered up entirely on the bottom side.
OK1-OK8 = optocoupler:PC817: SHARP OPTO COUPLER; MPN: PC817X4J000F; OC_FARNELL: 9707727; OC_NEWARK: 97K7059
S1 = SparkFun-Retired:TAC_SWITCH: Momentary Switch Button commonly used for reset or general input. Spark Fun Electronics SKU : COM-00097 SMT- SWCH-08247
STM_D_CAPS1 = adafruit:C-US: CAPACITOR, American symbol
SW3 = dp_devices:SW_PUSH_DPDT
U1 = SparkFun-IC-Microcontroller:ATMEGA328P_PDIP: Atmel 328P Through hole ATMEGA328P uC used in the Arduino 32kb flash, 1k EEPROM, 2k SRAM Datasheet <http://www.sparkfun.com/datasheets/Components/SMD/ATMega328.pdf> SparkFun Products Storefront component: AVR 28 Pin 20MHz 32K 6A/D - ATMega328P <https://www.sparkfun.com/products/9061> (COM-09061) SparkFun Simon Says - Through-Hole Soldering Kit <https://www.sparkfun.com/products/10547> (KIT-10547) SparkFun Learn to Solder - Simon Says <https://www.sparkfun.com/products/13708> (KIT-13708) SparkFun BigTime Watch Kit <https://www.sparkfun.com/products/11734> (KIT-11734) SparkFun ClockIt <https://www.sparkfun.com/products/10930> (KIT-10930) SparkFun Serial Enabled LCD Kit <https://www.sparkfun.com/products/10097> (LCD-10097) SparkFun Simon Tilts - Through Hole Soldering Kit <https://www.sparkfun.com/products/12634> (KIT-12634) SparkFun Frequency Counter Kit <https://www.sparkfun.com/products/10140> (KIT-10140) FabFM Radio Kit <https://www.sparkfun.com/products/11043> (KIT-11043) SparkFun Binary Blaster Kit <https://www.sparkfun.com/products/12037> (KIT-12037) SparkFun Metro-Gnome <https://www.sparkfun.com/products/9236> (KIT-09236) ATmega328 with Arduino Optiboot (Uno) <https://www.sparkfun.com/products/10524> (DEV-10524); PROD_ID: IC-09136
U$1 = ESP32-DEVKITC:ESP32DEVKITC
U$2 = BluePill:BLUE_PILL

## Board
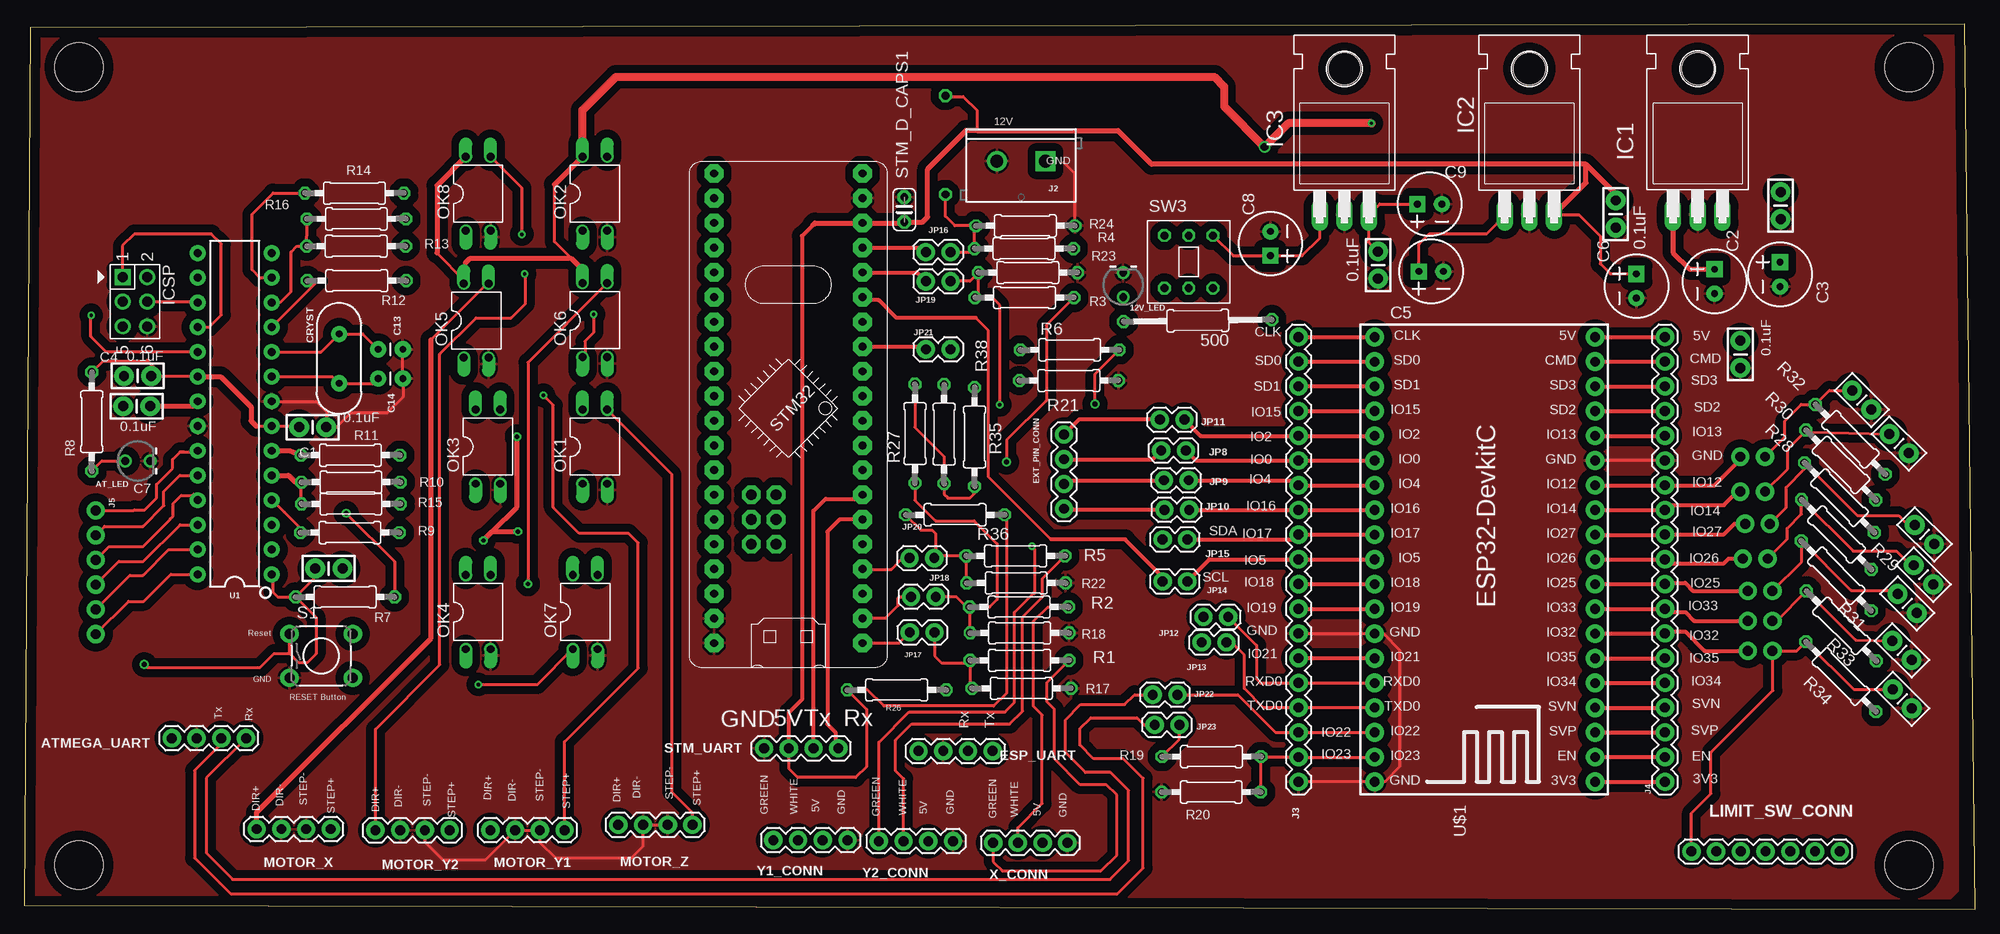
[diagram p3: board, top side]
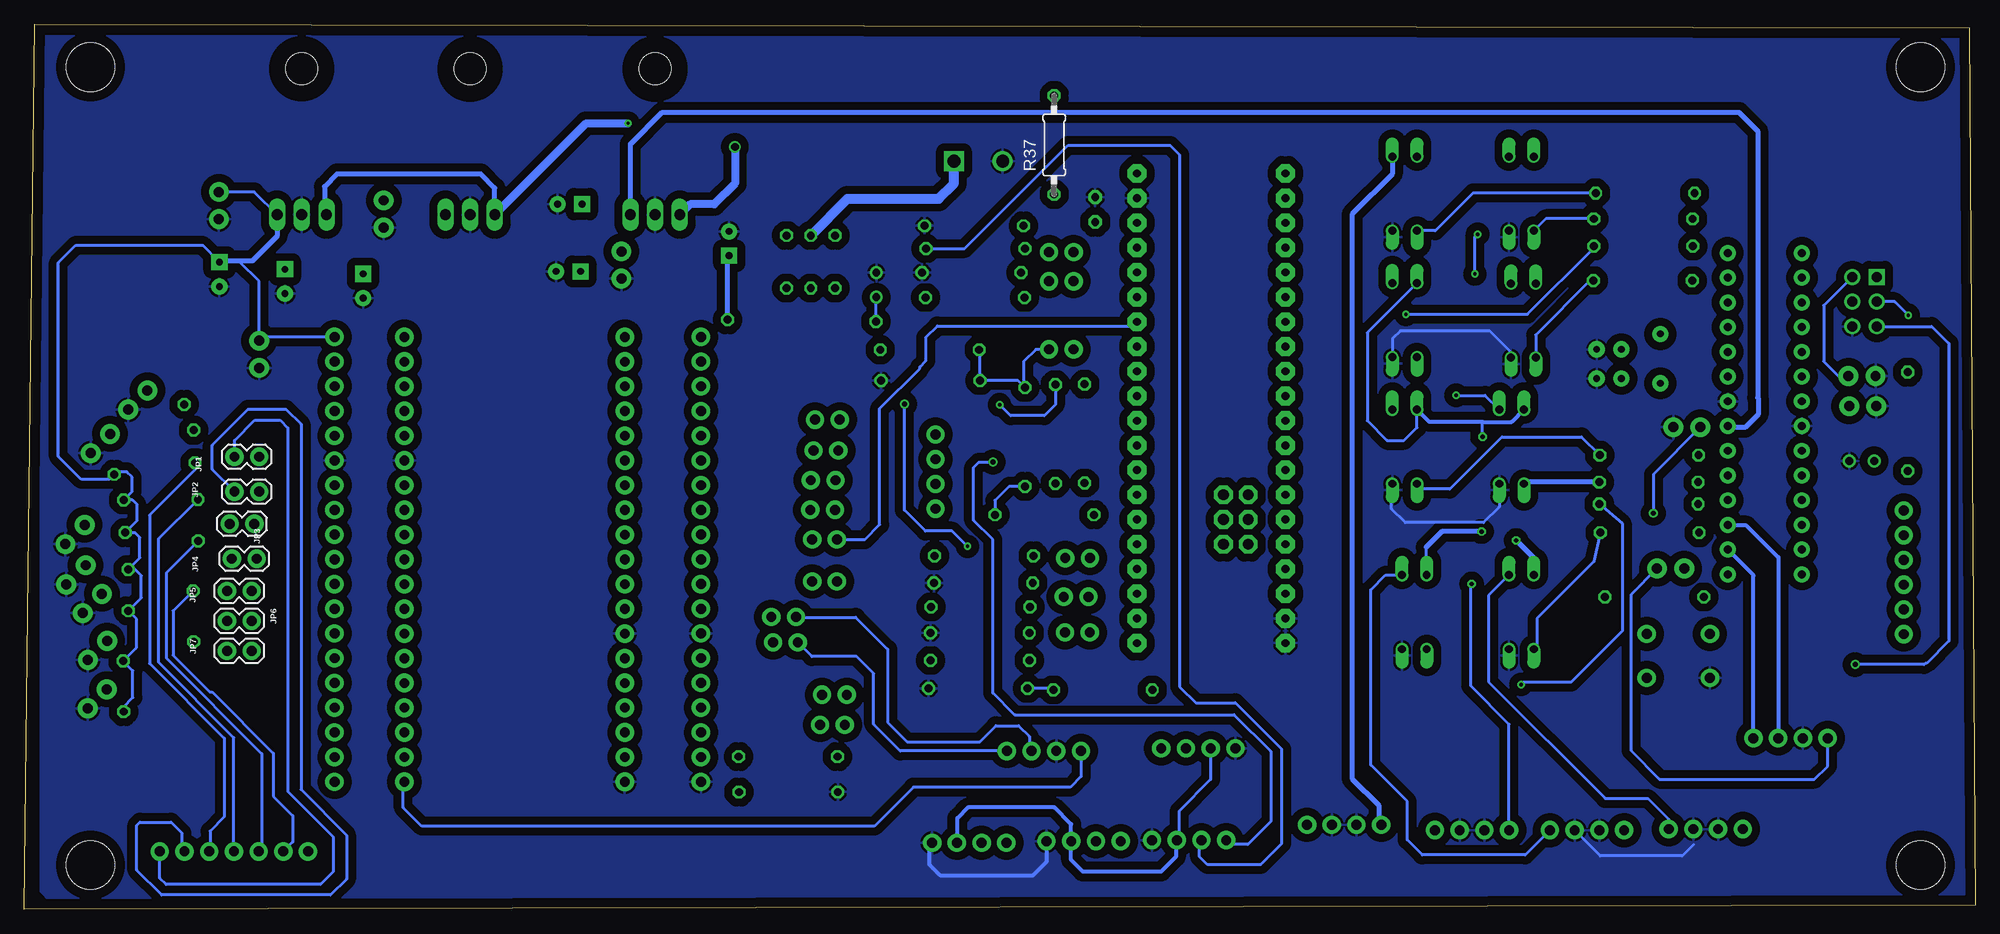
[diagram p4: board, bottom side, seen from below]

Size 200.42 x 90.95 mm. Coordinates in mm from the lower left corner, seen from the top.
Outline: 0,0.41 200.42,0 199.36,90.95 0.6,90.58 0,0.41
Copper layers (1*16): Top 0.035mm / dielectric 1.5mm / Bottom 0.035mm
Design rules "default *": minimum track width 12mil, minimum drill 0.35mm, track to track 12mil, track to pad 12mil, pad to pad 12mil, via to via 12mil, smd to smd 6mil, copper to edge 40mil, drill to drill 12mil, minimum pad ring 10mil, minimum via ring 8mil, stop-mask expansion 4mil, vias tented up to drill 0mil, thermal gap 10mil
Holes 5 mm at 5.62,86.55 193.62,86.55 5.62,4.55 193.62,4.55

### Footprints (pad centres in the part's own frame; a part is rotated, then mirrored left to right if it is on the bottom)
LED_3MM-NS = drill 0.813: A -1.27,0; K 1.27,0
0207/15 = drill 0.813 octagon: 1 -7.62,0; 2 7.62,0
1X04 = drill 1.016 pad 1.88: 1 0,0; 2 2.54,0; 3 5.08,0; 4 7.62,0
CAP-PTH-SMALL-KIT = drill 1.016 pad 2.032: 1 -1.397,0; 2 1.397,0
CPOL-RADIAL-2.5MM-6.5MM = drill 0.7 pad 1.651 square: 1 1.25,0 | drill 0.7 pad 1.651: 2 -1.25,0
CAP-PTH-2.54 = drill 0.7 pad 1.651: 1 -1.27,0; 2 1.27,0
HC49US = drill 0.7 pad 1.651: 1 -2.54,0; 2 2.54,0
TO220H = drill 1.118 long: 1 -2.54,-10.16; 2 0,-10.16; 3 2.54,-10.16 | hole 3.302: 0,4.826
HEADER_PRG_2X03 = drill 1.02 pad 1.632 square: 1 -2.54,-1.27 | drill 1.02 pad 1.632: 2 -2.54,1.27; 3 0,-1.27; 4 0,1.27; 5 2.54,-1.27; 6 2.54,1.27
SCREWTERMINAL-5MM-2 = drill 1.3 pad 2.032 square: 1 0,0 | drill 1.3 pad 2.032: 2 5,0
1X19 = drill 1.016 pad 1.88: 1 0,0; 2 2.54,0; 3 5.08,0; 4 7.62,0; 5 10.16,0; 6 12.7,0; 7 15.24,0; 8 17.78,0; 9 20.32,0; 10 22.86,0; 11 25.4,0; 12 27.94,0; 13 30.48,0; 14 33.02,0; 15 35.56,0; 16 38.1,0; 17 40.64,0; 18 43.18,0; 19 45.72,0
1X06_NO_SILK = drill 1.016 pad 1.88: 1 0,0; 2 2.54,0; 3 5.08,0; 4 7.62,0; 5 10.16,0; 6 12.7,0
1X02 = drill 1.016 pad 1.88: 1 0,0; 2 2.54,0
1X07 = drill 1.016 pad 1.88: 1 0,0; 2 2.54,0; 3 5.08,0; 4 7.62,0; 5 10.16,0; 6 12.7,0; 7 15.24,0
DIL04 = drill 0.813 offset: 1 -1.27,-3.81; 2 1.27,-3.81; 3 1.27,3.81; 4 -1.27,3.81
0207/10 = drill 0.813 octagon: 1 -5.08,0; 2 5.08,0
TACTILE-PTH = drill 1.016 pad 1.88: 1 -3.251,2.261; 2 3.251,2.261; 3 -3.251,-2.261; 4 3.251,-2.261
C025-024X044 = drill 0.813 pad 1.422 octagon: 1 -1.27,0; 2 1.27,0
SW_PUSH_BUTTON_MINI = drill 0.8 octagon: 1 2.5,2.7; 2 0,2.7; 3 -2.5,2.7; 4 2.5,-2.7; 5 0,-2.7; 6 -2.5,-2.7
DIP28 = drill 0.813 pad 1.626: 1 -16.51,-3.81; 2 -13.97,-3.81; 3 -11.43,-3.81; 4 -8.89,-3.81; 5 -6.35,-3.81; 6 -3.81,-3.81; 7 -1.27,-3.81; 8 1.27,-3.81; 9 3.81,-3.81; 10 6.35,-3.81; 11 8.89,-3.81; 12 11.43,-3.81; 13 13.97,-3.81; 14 16.51,-3.81; 15 16.51,3.81; 16 13.97,3.81; 17 11.43,3.81; 18 8.89,3.81; 19 6.35,3.81; 20 3.81,3.81; 21 1.27,3.81; 22 -1.27,3.81; 23 -3.81,3.81; 24 -6.35,3.81; 25 -8.89,3.81; 26 -11.43,3.81; 27 -13.97,3.81; 28 -16.51,3.81
ESP32-DEVKITC = drill 1 pad 1.93: 1 -22.87,-11.42; 2 -20.33,-11.42; 3 -17.79,-11.42; 4 -15.25,-11.42; 5 -12.71,-11.42; 6 -10.17,-11.42; 7 -7.63,-11.42; 8 -5.09,-11.42; 9 -2.55,-11.42; 10 -0.01,-11.42; 11 2.53,-11.42; 12 5.07,-11.42; 13 7.61,-11.42; 14 10.15,-11.42; 15 12.69,-11.42; 16 15.23,-11.42; 17 17.77,-11.42; 18 20.31,-11.42; 19 22.85,-11.42; 20 22.85,11.23; 21 20.31,11.23; 22 17.77,11.23; 23 15.23,11.23; 24 12.69,11.23; 25 10.15,11.23; 26 7.61,11.23; 27 5.07,11.23; 28 2.53,11.23; 29 -0.01,11.23; 30 -2.55,11.23; 31 -5.09,11.23; 32 -7.63,11.23; 33 -10.17,11.23; 34 -12.71,11.23; 35 -15.25,11.23; 36 -17.79,11.23; 37 -20.33,11.23; 38 -22.87,11.23
BLUE_PILL_ADV = drill 0.8 pad 1.93 octagon: P$1 10.16,-30.48; P$2 10.16,-27.94; P$3 10.16,-25.4; P$4 10.16,-22.86; P$5 10.16,-20.32; P$6 10.16,-17.78; P$7 10.16,-15.24; P$8 10.16,-12.7; P$9 10.16,-10.16; P$10 10.16,-7.62; P$11 10.16,-5.08; P$12 10.16,-2.54; P$13 10.16,0; P$14 10.16,2.54; P$15 10.16,5.08; P$16 10.16,7.62; P$17 10.16,10.16; P$18 10.16,12.7; P$19 10.16,15.24; P$20 10.16,17.78; P$21 -5.08,-30.48; P$22 -5.08,-27.94; P$23 -5.08,-25.4; P$24 -5.08,-22.86; P$25 -5.08,-20.32; P$26 -5.08,-17.78; P$27 -5.08,-15.24; P$28 -5.08,-12.7; P$29 -5.08,-10.16; P$30 -5.08,-7.62; P$31 -5.08,-5.08; P$32 -5.08,-2.54; P$33 -5.08,0; P$34 -5.08,2.54; P$35 -5.08,5.08; P$36 -5.08,7.62; P$37 -5.08,10.16; P$38 -5.08,12.7; P$39 -5.08,15.24; P$40 -5.08,17.78 | drill 1.1 pad 1.93 octagon: P$42 -1.27,-20.32; P$43 -1.27,-17.78; P$44 -1.27,-15.24; P$45 1.27,-15.24; P$46 1.27,-17.78; P$47 1.27,-20.32

### Placement (x,y rotation side)
12V_LED  112.9,64.18 90 top
500  120.55,60.5 180.7 top
AT_LED  11.65,46.08 0 top
ATMEGA_UART  22.78,17.59 180 top
C1  29.62,49.55 0 top
C2  173.65,64.53 90 top
C3  180.38,65.25 90 top
C4  11.63,54.82 180 top
C5  144.53,65.56 180 top
C6  165.63,64.06 90 top
C7  11.55,51.71 180 top
C8  128.01,68.42 270 top
C9  144.38,72.47 180 top
C10  180.44,72.33 270 top
C11  163.49,71.45 270 top
C12  139.08,66.21 270 top
C13  37.62,57.55 180 top
C14  37.62,54.55 180 top
C15  31.29,35.02 0 top
C18  195.22,38.52 135 top
C19  195.12,34.38 135 top
C20  192.6,47.87 135 top
C21  193.44,31.43 135 top
C22  188.77,52.34 135 top
C23  192.91,26.61 135 top
C24  192.93,21.63 135 top
CRYST  32.33,56.6 270 top
ESP_D_CAPS  176.3,57.04 270 top
ESP_UART  99.48,16.27 180 top
EXT_PIN_CONN  106.81,41.17 90 top
IC1  171.92,81.56 0 top
IC2  154.62,81.55 0 top
IC3  135.62,81.55 0 top
ICSP  11.36,62.45 270 top
J2  104.92,76.89 180 top
J3  130.91,13.11 90 top
J4  168.55,13.11 90 top
J5  7.33,40.99 270 top
JP1  176.29,46.51 180 bottom
JP2  176.29,42.93 180 bottom
JP3  176.79,39.62 180 bottom
JP4  176.56,36.04 180 bottom
JP5  177.06,32.73 180 bottom
JP6  177.06,29.65 180 bottom
JP7  177.06,26.57 180 bottom
JP8  119.34,47.16 180 top
JP9  119.62,44.09 180 top
JP10  119.67,41.06 180 top
JP11  119.19,50.32 180 top
JP12  123.68,30.05 180 top
JP13  123.5,27.44 180 top
JP14  119.48,33.7 180 top
JP15  119.48,38.01 180 top
JP16  92.62,67.55 0 top
JP17  90.97,28.45 0 top
JP18  91.1,32.12 0 top
JP19  92.62,64.55 0 top
JP20  90.94,36.1 0 top
JP21  92.62,57.55 0 top
JP22  118.47,22.06 180 top
JP23  118.67,18.96 180 top
LIMIT_SW_CONN  186.51,5.95 180 top
MOTOR_X  31.49,8.25 180 top
MOTOR_Y1  55.5,8.14 180 top
MOTOR_Y2  43.69,8.13 180 top
MOTOR_Z  68.64,8.69 180 top
OK1  58.62,47.55 0 top
OK2  58.62,73.55 0 top
OK3  47.62,47.55 0 top
OK4  46.62,30.55 0 top
OK5  46.42,60.51 0 top
OK6  58.62,60.55 0 top
OK7  57.62,30.55 0 top
OK8  46.62,73.55 0 top
R1  102.25,25.58 0 top
R2  102.19,31.07 0 top
R3  102.75,62.87 0 top
R4  102.7,67.91 0 top
R5  101.84,36.33 0 top
R6  107.4,57.5 0 top
R7  32.95,32.11 0 top
R8  6.93,50.12 270 top
R9  33.44,38.71 0 top
R10  33.55,43.9 0 top
R11  33.5,46.67 0 top
R12  34.15,64.61 0 top
R13  34.09,68.15 0 top
R14  33.91,73.61 0 top
R15  33.55,41.66 0 top
R16  34.11,70.96 0 top
R17  102.43,22.71 180 top
R18  102.25,28.41 180 top
R19  121.97,15.7 0 top
R20  121.93,12.05 180 top
R21  107.32,54.35 180 top
R22  101.9,33.53 180 top
R23  103.1,65.44 180 top
R24  102.84,70.24 180 top
R26  89.62,22.55 180 top
R27  91.5,48.89 90 top
R28  186.48,42.31 135 top
R29  186.17,38.52 135 top
R30  186.63,45.66 135 top
R31  186.15,34.28 135 top
R32  187.6,48.3 135 top
R33  186.68,29.12 135 top
R34  186.63,23.92 135 top
R35  97.62,48.55 270 top
R36  95.62,40.55 0 top
R37  94.62,78.55 90 bottom
R38  94.5,48.84 270 top
S1  30.5,26.05 0 top
STM_D_CAPS1  90.41,71.91 90 top
STM_UART  83.62,16.55 180 top
SW3  119.62,66.55 0 top
U1  21.61,50.94 90 top
U$1  149.96,35.97 90 top
U$2  75.95,57.84 0 top
X_CONN  99.53,6.84 0 top
Y1_CONN  76.94,7.11 0 top
Y2_CONN  87.79,7.01 0 top

### Tracks (layer width: path | path; a pad name or v marks a point on that pad's centre or on a via)
3V3
  Top 0.406: U$1.1 J4.1
  Bottom 0.305: ESP_UART.4 91.86,13.65 92.96,12.56 109.09,12.56 113.1,8.55 159.58,8.55 161.48,10.45 161.48,12.99 U$1.1
12V
  Bottom 1.016: SW3.2 115.85,73.01 106.49,73.01 104.91,74.59 J2.1
12V_SIN  (via drill 0.35, 0.45, 0.81)
  Top 0.305: OK6.4 57.35,65.72 | SW3.1 124.2,67.17 C8.1 131.28,67.17 133.08,68.97 IC3.1 | 56.2,66.87 54.47,68.6 54.47,74.48 | 42.38,67.45 45.15,64.68 OK5.4 45.33,64.5 45.33,66.46 | C5.1 143.28,68.35 144.37,69.43 150.23,69.43 152.08,71.28 IC2.1
  Top 0.508: v47.16,37.91 48.07,38.83 | 48.07,38.83 v50.72,38.83 | 48.07,38.83 50.61,41.37 v50.61,48.58 | 57.35,65.72 56.2,66.87 45.74,66.87 45.33,66.46 | OK8.4 42.38,74.39 42.38,67.45 | 54.47,74.48 OK2.4 | IC1.1 169.38,67.51 171.11,65.78 C2.1
  Top 0.813: v138.4,80.79 129.86,80.79 v127.42,78.35 123.26,82.51 123.26,84.55 122.24,85.56 60.77,85.56 57.35,82.14 OK2.4
  Bottom 0.305: 56.41,37.2 56.41,34.42 OK7.4 | v50.61,48.58 50.61,50.1 | 151.51,70.82 IC2.1 | OK6.4 62.45,59.26 62.45,50.23 60.42,48.2 58.67,48.2 57.35,49.52 OK1.4
  Bottom 0.406: OK3.4 47.61,50.1 50.61,50.1 56.09,50.1 OK1.4
  Bottom 0.508: OK4.4 45.35,36.1 v47.16,37.91 | v50.72,38.83 54.78,38.83 56.41,37.2 | IC2.1 152.08,74.12 153.51,75.55 168.32,75.55 169.59,74.28 169.59,71.61 IC1.1 | 500.1 128.17,67 C8.1
  Bottom 0.813: IC2.1 142.68,80.79 v138.4,80.79 | v127.42,78.35 127.42,74.59 129.56,72.46 132.01,72.46 IC3.1
A0
  Top 0.305: 16.37,47.01 16.1,47.01 | 16.37,47.01 17.68,47.01 U1.23 | J5.1 11.22,40.99 11.29,41.06 12.39,41.06 13.58,42.26 13.58,43.68 15.23,45.33 15.23,46.24 15.99,47.01 16.37,47.01
A1
  Top 0.305: J5.2 8.25,39.36 12.21,39.36 14.34,41.49 14.34,42.97 15.97,44.59 U1.24
A2
  Top 0.305: J5.3 8.7,37.28 12.21,37.28 14.95,40.02 14.95,40.05 15.28,40.38 15.28,41.7 16.12,42.53 17.26,42.53 17.37,42.64 17.8,42.2 U1.25
A3
  Top 0.305: J5.4 9.72,35.75 12.23,35.75 15.99,39.51 U1.26
A4
  Top 0.305: J5.5 10.84,34.33 12.21,34.33 14.85,36.97 U1.27
A5
  Top 0.305: J5.6 10.71,31.66 12.29,31.66 15.05,34.43 U1.28
AT_5V  (via drill 0.51)
  Top 0.305: C1.1 28.1,49.67 U1.7 23.82,49.67 | U1.20 17.73,54.82 C4.1 13.35,55.15 13.35,55.67 12.62,56.4 12.56,56.35 8.08,56.35 R8.1 | C12.1 138.16,68.53 IC3.3 139.24,72.47 C9.1 | v33.06,40.71 38.03,35.74 R7.2
  Top 0.508: U1.20 20.16,54.75 23.28,51.63 23.28,50.21 23.82,49.67
  Bottom 0.305: ICSP.2 15.56,62.06 15.56,56.3 14.08,54.82 C4.1 | C1.1 33.06,44.71 v33.06,40.71
  Bottom 0.508: IC3.3 138.16,78.64 134.89,81.9 24.27,81.9 22.34,79.97 22.34,52.59 22.29,52.54 22.29,50.87 23.64,49.52 25.27,49.52 U1.7
AT_JRX
  Top 0.305: ATMEGA_UART.1 18.69,13.5 18.69,5.81 21.4,3.09 111.55,3.09 113.45,4.99 113.45,12.21 111.6,14.06 109.01,14.06 106.95,16.12 106.95,19.47 108.53,21.05 113.05,21.05 114.06,22.06 JP22.2
  Bottom 0.406: U1.2 22.76,34.31 22.78,34.29 ATMEGA_UART.1
AT_JTX
  Top 0.305: ATMEGA_UART.2 20.24,17.01 17.49,14.26 17.49,5.3 21.18,1.62 112.31,1.62 114.93,4.23 114.93,13.48 112.92,15.48 109.85,15.48 108.45,16.88 108.45,18.59 109.56,19.7 114.29,19.7 115.03,18.96 JP23.2
  Bottom 0.406: U1.3 25.35,39.44 23.49,39.44 20.22,36.17 20.22,17.61 ATMEGA_UART.2
AT_MISO
  Top 0.305: U1.18 18.99,59.83 20.24,61.08 20.24,68.39 19.22,69.41 11.29,69.41 10.08,68.19 10.08,65 ICSP.1
AT_MOSI
  Top 0.305: ICSP.4 17.72,62.45 U1.17
AT_RESET  (via drill 0.51)
  Top 0.305: U1.1 25.52,34.33 25.52,32.63 26.04,32.11 R7.1 | R7.1 29.89,34.12 C15.1 | R7.1 29.96,30.01 29.96,26.25 29.05,25.34 28.19,25.34 27.25,26.28 | v12.34,25.16 12.64,24.86 24.22,24.86 25.65,26.28 27.25,26.28 | 27.25,26.28 S1.1
  Bottom 0.305: ICSP.5 4.46,59.91 2.71,58.16 2.71,27.57 5,25.29 5.12,25.29 5.25,25.16 v12.34,25.16
AT_RX
  Top 0.305: 131.26,18.18 U$1.36 | 131.26,18.18 J3.3 | JP22.1 124.66,22.06 128.52,18.2 131.24,18.2 131.26,18.18
AT_SCK  (via drill 0.35)
  Top 0.305: ICSP.3 10.09,62.08 | v6.88,61.05 6.82,61 6.82,58.87 8.4,57.29 U1.19
  Bottom 0.305: v6.88,61.05 8.27,62.45 ICSP.3
AT_TX
  Top 0.305: R20.1 127.05,12.1 R19.2 127.1,15.65 J3.2 U$1.37
CLK
  Top 0.406: J3.19 U$1.20
CMD
  Top 0.406: U$1.18 J4.18
DIR_X
  Top 0.305: R12.1 30.2,64.61 U1.11
DIR_XO
  Top 0.305: 41.77,58.54 47.56,64.32 OK5.3
  Top 0.508: MOTOR_X.4 23.87,9.95 41.77,27.85 41.77,58.54
DIR_Y
  Top 0.305: R16.1 29.03,69.19 R13.1 27.99,68.15 27.4,67.56 27.4,63.46 26.3,62.37 U1.12
DIR_Y1O  (via drill 0.45)
  Top 0.305: v51.73,33.44 51.73,56.2 OK6.3
  Bottom 0.305: MOTOR_Y1.4 47.88,19.02 51.83,22.98 51.83,33.34 v51.73,33.44
DIR_Y2O  (via drill 0.35)
  Top 0.305: MOTOR_Y2.4 36.07,18.52 42.69,25.14 42.69,57.06 46.4,60.77 50,60.77 51.48,62.25 51.48,65.22 v51.4,65.29 | v51.12,69.38 51.12,74.13 OK8.3
  Bottom 0.305: v51.4,65.29 51.4,69.1 v51.12,69.38
DIR_Z
  Top 0.305: U1.13 25.37,64.86 24.25,64.86 23.39,65.72 23.39,71.44 25.55,73.61 R14.1
DIR_ZO
  Bottom 0.305: 61.28,8.95 MOTOR_Z.4
  Bottom 0.508: OK2.3 59.89,75.58 64.03,71.44 64.03,13.43 61.28,10.68 61.28,8.95
DTR
  Bottom 0.305: C15.2 35.37,32.33 35.37,16.32 32.43,13.38 16.5,13.38 15.16,14.72 ATMEGA_UART.4
EN
  Top 0.406: U$1.2 J4.2
ENC_X_GR
  Top 0.406: U$2.P$16 91.71,65.46 JP19.1
ENC_X_JGR  (via drill 0.51)
  Top 0.305: R3.2 105,60.04 105,52.31 100.91,48.22 v100.91,45.96
  Bottom 0.305: Y1_CONN.1 76.5,6.67 74.72,6.67 72.36,9.03 72.36,16.22 76.14,20 98.67,20 100.91,22.24 100.91,37.99 102.89,39.97 102.89,45.43 102.35,45.96 v100.91,45.96
ENC_X_JWH
  Bottom 0.305: R4.2 103.81,67.91 93.19,78.53 82.72,78.53 81.73,77.54 81.73,22.88 80.08,21.22 76.01,21.22 71.27,16.47 71.27,6.75 73.42,4.59 78.86,4.59 79.67,5.4 79.67,6.92 Y1_CONN.2
ENC_X_WH
  Top 0.406: U$2.P$17 92.17,68 JP16.1
ENC_Y1_GR
  Top 0.305: U$2.P$1 89.87,27.36 JP17.1
ENC_Y1_JGR
  Top 0.305: X_CONN.1 99.53,4.89 100.47,3.95 110.61,3.95 112.23,5.58 112.23,11.75 111.17,12.82 108.48,12.82 105.81,15.48 105.81,20.56 105.07,21.3 105.07,23.33 R1.2
ENC_Y1_JWH
  Top 0.305: X_CONN.2 102.07,8.4 104.56,10.89 104.56,19.98 103.7,20.84 103.7,29.63 105.14,31.07 R2.2
ENC_Y1_WH
  Top 0.305: U$2.P$2 86.15,29.94 88.49,29.94 89.78,31.23 89.78,31.94 89.96,32.12 JP18.1
ENC_Y2_GR
  Top 0.406: U$2.P$13 92.33,57.84 JP21.1
ENC_Y2_JGR  (via drill 0.35, 0.51)
  Top 0.305: Y2_CONN.1 87.79,17.17 90.9,20.28 100.75,20.28 101.72,21.25 101.72,30.52 103.67,32.48 103.83,32.48 103.83,37 v103.52,37.3 | v110,51.93 110,55.02 R6.2
  Bottom 0.305: v103.52,37.3 105.1,38.88 107.84,38.88 110,41.04 v110,51.93
ENC_Y2_JWH
  Top 0.305: Y2_CONN.2 90.33,13.41 89.53,14.21 89.53,17.41 91.15,19.04 101.24,19.04 102.56,20.36 102.56,30.06 104.59,32.1 104.59,34 R5.2
ENC_Y2_WH
  Top 0.305: U$2.P$4 86.15,34.94 89.07,34.94 90.23,36.1 JP20.1
ESP32_5V
  Top 0.406: U$1.19 J4.19 | 175.97,58.83 ESP_D_CAPS.1
  Bottom 0.305: R34.1 190.22,20.83 189.27,21.78 189.27,24.53 R33.1 188.92,26.89 188.89,26.89 188.89,29.84 R31.1 188.41,32.02 188.41,34.31 189.03,34.93 R29.1 188.56,36.13 188.56,38.22 189.06,38.71 R28.1 188.89,39.89 188.89,41.67 189.29,42.07 R30.1 189.35,42.94 189.35,44.41 189.88,44.95 190.95,44.95 R32.1 191.71,44.19 194.56,44.19 196.92,46.55 196.92,66.46 195.14,68.24 182.11,68.24 C3.1 180.34,66.54 178.3,66.54 176.3,64.54 ESP_D_CAPS.1 175.91,58.83 J4.19 | IC1.3 176.78,73.72 C10.1
  Bottom 0.508: IC1.3 174.46,69.18 177,66.64 180.24,66.64 C3.1
ESP32_I2C_JSCL
  Top 0.305: 105.48,38.01 99.05,44.44 99.05,59.48 97.76,60.77
  Top 0.406: JP14.2 116.94,34.17 113.1,38.01 105.48,38.01 | 97.76,60.77 89.63,60.77 87.8,62.6 86.43,62.6 U$2.P$15
ESP32_I2C_JSDA
  Bottom 0.305: JP15.2 114.07,38.01 112.54,39.54 112.54,51.48 108.42,55.59 108.42,55.74 107.79,56.38 107.79,58.79 106.62,59.96 86.53,59.96 U$2.P$14
ESP32_I2C_SCL
  Top 0.406: U$1.29 J3.10 121.75,35.97 JP14.1
ESP32_I2C_SDA
  Top 0.406: U$1.28 J3.11 130.41,38.01 JP15.1
ESP32_JRX
  Bottom 0.305: JP12.2 121.1,30.01 115,30.01 111.73,26.74 111.73,19.22 109.75,17.24 102.23,17.24 100.6,18.86 98.27,18.86 97.17,17.77 97.17,16.5 ESP_UART.2
ESP32_JTX
  Bottom 0.305: ESP_UART.1 110.43,16.27 113.18,19.01 113.18,24.25 114.9,25.97 119.5,25.97 JP13.2
ESP32_RX
  Top 0.305: JP12.1 126.59,27.14 126.59,23.66 126.98,23.27 J3.5 U$1.34
ESP32_TX
  Top 0.305: U$1.35 J3.4 127.31,20.73 125.34,22.7 125.34,26.13 124.03,27.44 JP13.1
EXT_P1
  Top 0.406: 131.08,48.66 U$1.24 | 131.08,48.66 J3.15 | JP11.1 120.85,48.66 131.08,48.66
EXT_P2
  Top 0.406: U$1.25 J3.14 120.37,46.13 JP8.1
EXT_P3
  Top 0.406: U$1.26 J3.13 130.41,44.09 JP9.1
EXT_P4
  Top 0.406: J3.12 | J3.12 U$1.27 | JP10.1 119.69,41.04 J3.12
EXT_PJ1
  Top 0.406: JP11.2 108.34,50.32 EXT_PIN_CONN.4
EXT_PJ2
  Top 0.406: EXT_PIN_CONN.3 115.89,46.25 JP8.2
EXT_PJ3
  Top 0.406: EXT_PIN_CONN.2 107.19,44.09 JP9.2
EXT_PJ4
  Top 0.406: JP10.2 106.92,41.06 EXT_PIN_CONN.1
GND
  Top 0.305: 176.04,55.38 ESP_D_CAPS.2 | J4.14 U$1.14 | J3.7 U$1.32 139.61,28.34 141.29,26.66 141.29,14.65 139.76,13.11 U$1.38 | U$1.38 J3.1 | U$1.38 | U1.8 29.97,52.21 31.08,51.09 31.08,49.61 C1.2 32.1,49.55 33.6,51.04 37.28,51.04 38.96,52.72 38.96,54.48 C14.1 C13.1 | MOTOR_Y2.2 41.15,6.94 42.99,5.1 47.37,5.1 MOTOR_Y1.3 MOTOR_Y1.2 52.96,6.91 54.58,5.3 62.4,5.3 63.62,6.52 63.56,6.58 MOTOR_Z.3 MOTOR_Z.2 | R24.1 107.92,75.62 106.8,76.75
  Bottom 0.305: OK3.2 48.89,41.36 50.51,39.74 58.54,39.74 59.96,41.16 59.96,43.67 OK1.2 | OK5.2 47.69,57.26 49.88,59.45 59.07,59.45 59.86,58.66 59.86,56.77 OK6.2 | 28.95,6.64 30.09,5.5 38.52,5.5 MOTOR_Y2.2
  Bottom 0.406: Y2_CONN.4 95.41,4.9 96.84,3.47 106.29,3.47 107.41,4.59 107.41,6.58 X_CONN.4
  pour Bottom (isolate 0.813): 1.77,0.85 0.73,1.89 0.73,1.97 0.73,89.52 1.29,90.08 198.44,90.08 198.8,89.73 198.8,1.84 197.81,0.85
  pour Top (isolate 0.813): 198.44,90.08 1.26,90.08 0.73,89.55 0.73,1.92 1.77,0.88 197.66,0.88 198.7,1.92 198.7,89.83
IO13
  Top 0.406: U$1.15 J4.15
IO15
  Top 0.406: J3.16 U$1.23
IO18
  Top 0.406: J3.9 U$1.30
IO19
  Top 0.406: J3.8 U$1.31
IO21
  Top 0.406: U$1.33 J3.6
IO34
  Top 0.406: U$1.5 J4.5
IO35
  Top 0.406: U$1.6 J4.6
LIMIT_SW1
  Top 0.406: U$1.13 J4.13 168.59,43.55 173.62,43.55 176.29,46.22 JP1.1
LIMIT_SW2
  Top 0.406: U$1.12 J4.12 169.05,41.55 174.62,41.55 176,42.93 JP2.1
LIMIT_SW3
  Top 0.406: U$1.11 J4.11 168.59,38.55 174.62,38.55 175.69,39.62 JP3.1
LIMIT_SW4
  Top 0.406: U$1.10 J4.10 168.97,35.55 174.62,35.55 175.11,36.04 JP4.1
LIMIT_SW5
  Top 0.406: U$1.9 J4.9 168.67,33.55 170.62,33.55 171.44,32.73 JP5.1
LIMIT_SW6
  Top 0.406: U$1.8 J4.8 168.89,30.55 170.62,30.55 171.52,29.65 JP6.1
LIMIT_SW7
  Top 0.406: U$1.7 J4.7 168.75,28.55 170.62,28.55 172.6,26.57 JP7.1
LIMIT_SWJ1
  Top 0.305: C22.2 185.44,53.33 R32.2 182.55,51.89 180.84,50.18 180.84,48.52 JP1.2
  Bottom 0.305: JP1.2 178.83,48.2 176.75,50.28 174.16,50.28 173.35,49.47 173.35,12.11 168.67,7.43 168.67,3.88 169.99,2.56 185.87,2.56 186.51,3.2 LIMIT_SW_CONN.1
LIMIT_SWJ2
  Top 0.305: C20.2 183.26,49.03 R30.2 183.04,49.15 181.17,47.28 181.17,45.27 JP2.2
  Bottom 0.305: JP2.2 181.12,45.22 181.12,47.72 177.44,51.4 173.55,51.4 172,49.85 172,12.31 167.33,7.64 167.33,3.11 168.97,1.48 186.31,1.48 188.87,4.03 188.87,8.65 188.56,8.96 185.34,8.96 184.24,7.86 184.24,6.23 LIMIT_SW_CONN.2
LIMIT_SWJ3
  Top 0.305: C18.2 193.42,39.59 192.55,40.45 188.33,40.45 R28.2 182.89,45.27 180.99,43.37 180.99,41.28 JP3.2
  Bottom 0.305: R28.2 182.89,45.19 187.55,40.53 187.55,25.26 179.88,17.59 179.88,9.51 181.35,8.04 181.35,6.04 LIMIT_SW_CONN.3
LIMIT_SWJ4
  Top 0.305: C19.2 193.77,35.37 192.32,36.82 187.88,36.82 R29.2 182.58,40.62 181.12,39.16 181.12,38.06 JP4.2
  Bottom 0.305: LIMIT_SW_CONN.4 178.89,17.65 186.61,25.36 186.61,38.09 R29.2
LIMIT_SWJ5
  Top 0.305: 182.59,37.84 R31.2 | 182.59,37.84 187.65,32.78 191.43,32.78 191.79,32.42 C21.2 | JP5.2 182.59,35.72 182.59,37.84
  Bottom 0.305: R31.2 185.84,34.58 185.84,25.82 176.01,15.99 176.01,6.29 LIMIT_SW_CONN.5
LIMIT_SWJ6
  Top 0.305: C23.2 188.11,27.7 R33.2 180.02,29.65 JP6.2
  Bottom 0.305: R33.2 | R33.2 185.13,30.67 185.13,26.1 181.37,22.34 181.15,22.34 174.85,16.04 174.85,11.62 172.84,9.62 172.84,6.93 LIMIT_SW_CONN.6
LIMIT_SWJ7
  Top 0.305: LIMIT_SW_CONN.7 171.27,9.88 173.27,11.88 173.27,16.12 179.65,22.49 179.65,26.52 JP7.2 182.1,26.57 R34.2 187.93,22.62 C24.2
N$1
  Top 0.305: U1.10 30.48,57.29 CRYST.1 34.76,59.14 C13.2
N$2
  Top 0.305: U1.9 31.64,54.75 CRYST.2 35.86,54.06 C14.2
N$3
  Top 0.305: R8.2 7.97,46.08 AT_LED.A
N$4
  Top 0.305: JP17.2 93.51,26.06 94.23,25.34 96.92,25.34 R1.1 97.17,22.9 R17.2
  Bottom 0.305: R26.1 94.86,22.71 R17.2
N$5
  Top 0.508: C7.1 17.3,51.71 U1.21
N$6
  Bottom 0.305: R9.2 39.16,35.75 45.03,29.89 45.03,27.06 OK4.1
N$7
  Bottom 0.508: R10.2 46.19,43.9 OK3.1
N$8
  Bottom 0.305: OK1.1 56.81,43.2 53.97,43.2 48.61,48.55 40.45,48.55 R11.2
N$9
  Bottom 0.305: R12.2 39.56,64.61 45.15,59.02 OK5.1
N$10
  Bottom 0.305: 54.3,70.91 54.07,71.14 | 54.3,70.91 55.46,69.74 OK2.1 | R14.2 51.59,73.61 54.3,70.91
N$11  (via drill 0.35)
  Top 0.305: v58.49,61.15 58.49,59.27 57.6,58.38 57.6,56.99 OK6.1
  Bottom 0.305: v58.49,61.15 45.99,61.15 39.17,67.98 R13.2
N$12  (via drill 0.35)
  Top 0.305: v46.65,23.1 52.71,23.1 OK7.1
  Bottom 0.305: R15.2 36.26,39.65 36.26,28.59 41.52,23.33 46.42,23.33 v46.65,23.1
N$13
  Bottom 0.305: R16.2 44.13,70.96 OK8.1
N$14  (via drill 0.35)
  Top 0.305: JP19.2 97.13,64.55 R23.2 98.02,63.22 R3.1 99.44,62.87 100.22,62.09 v100.22,51.86
  Bottom 0.305: R38.1 94.5,51.87 95.62,50.74 99.1,50.74 v100.22,51.86
N$15
  Top 0.305: JP16.2 97.27,67.55 R4.1 97.62,70.1 R24.2 95.6,70.24 94.62,71.22 R37.1
N$16
  Top 0.305: R19.1 118.67,17.48 JP23.1
N$17
  Top 0.305: R18.2 97.17,31.01 R2.1 | R2.1 96.8,31.07 95.75,32.12 JP18.2 | R27.1 91.5,42.04 93.62,39.92 97.58,39.92 99.94,37.56 99.94,31.84 99.17,31.07 R2.1
N$18
  Bottom 0.305: R6.1 102.23,57.41 R21.2 98.34,54.35 R35.1 97.76,53.77 97.76,56.3 96.51,57.55 JP21.2
N$20
  Top 0.305: R22.2 96.82,36.27 R5.1 93.71,36.33 93.61,36.22 | 93.61,36.22 JP20.2 | R36.1 92.11,38.98 93.26,38.98 93.61,38.63 93.61,36.22
N$22
  Bottom 0.305: 500.2 112.93,62.87 12V_LED.A
SD0
  Top 0.406: J3.18 U$1.21
SD1
  Top 0.406: U$1.22 J3.17
SD2
  Top 0.406: U$1.16 J4.16
SD3
  Top 0.406: U$1.17 J4.17
STEP_X
  Top 0.305: R9.1 28.36,39.16 26.73,40.79 | 26.73,40.79 26.66,40.86 | U1.4 25.47,42.05 26.73,40.79
STEP_XO
  Bottom 0.305: OK4.3 50,32.24 50,23.38 38.02,11.39 33.65,11.39 31.49,9.24 MOTOR_X.1
STEP_Y
  Top 0.305: 27.83,43.91 R10.1 R15.1
  Top 0.508: U1.5 27.15,44.59 27.83,43.91
STEP_Y1O  (via drill 0.35)
  Top 0.305: MOTOR_Y1.1 55.5,17.22 63.06,24.78 63.06,37.66 62.07,38.65 57.02,38.65 54.35,41.32 54.35,51.81 v53.33,52.82
  Bottom 0.305: v53.33,52.82 50.35,52.82 OK3.3
STEP_Y2O
  Bottom 0.305: MOTOR_Y2.1 46.22,5.6 56.81,5.6 58.34,7.13 58.34,11.09 62.09,14.85 62.09,32.83 60.57,34.36 OK7.3
STEP_Z
  Top 0.508: U1.6 27.27,47.13 R11.1
STEP_ZO
  Top 0.305: MOTOR_Z.1 68.64,9.93 66.54,12.03 66.54,44.71 OK1.3
STM_5V
  Top 0.305: IC2.3 159.71,71.39 161.89,69.2 161.89,66.33 162.92,65.31 C6.1 | 163.49,73.52 C11.1 | STM_UART.3 78.54,14.46 79.44,13.55 85.41,13.55 86.53,14.67 86.53,20.56 R26.2 86.65,22.55 88.31,20.89 99.59,20.89 100.91,22.21 100.91,40.34 R36.2 | R35.2 97.71,43.38 97.71,42.81 97.15,42.26 94.89,42.26 94.5,42.65 R38.2 94.5,46.53 91.5,49.53 R27.2 | R37.2 94.72,83.53 96.46,83.53 97.86,82.13 97.86,80.03
  Top 0.406: 81.01,70.33 79.88,69.2 79.88,21.55 78.54,20.22 STM_UART.3
  Top 0.508: 81.01,70.33 81.21,70.54 U$2.P$18 90.3,70.54 STM_D_CAPS1.1 92.28,70.64 92.8,71.16 92.8,76.09 96.74,80.03 97.86,80.03 112.36,80.03 115.82,76.57 160.44,76.57 | 157.6,70.95 IC2.3 160.44,74.67 160.44,76.57 | 160.44,76.57 163.49,73.52
  Bottom 0.152: X_CONN.3 104.56,6.89
  Bottom 0.305: STM_UART.3 78.54,13.34 81.78,10.1 81.78,7.35 Y1_CONN.3 | R35.2 99.26,43.47 100.7,42.03 R36.2
  Bottom 0.406: 104.56,6.89 104.56,9.36 103.45,10.48 94.61,10.48 92.87,8.74 Y2_CONN.3 92.87,5.08 91.66,3.88 83.63,3.88 82.11,5.4 82.11,7.02 Y1_CONN.3
STM_RX
  Top 0.406: U$2.P$6 83.75,40.06 82.52,38.83 82.52,19.01 83.33,18.2 83.33,16.84 STM_UART.1
STM_TX
  Top 0.406: STM_UART.2 81.08,40.95 82.31,42.18 85.69,42.18 U$2.P$7
SVN
  Top 0.406: U$1.4 J4.4
SVP
  Top 0.406: U$1.3 J4.3

### Text on the board
tNames: 12V | GND | 0.1uF | 0.1uF | CLK | 5V | C4 | 0.1uF | CMD | 0.1uF | SD0 | SD1 | SD3 | SD2 | IO15 | 0.1uF | 0.1uF | IO2 | IO13 | C1 | GND | IO0 | IO4 | IO12 | C7 | IO16 | IO14 | SDA | IO17 | IO27 | IO5 | IO26 | SCL | IO18 | IO25 | IO19 | IO33 | Reset | GND | IO32 | IO21 | IO35 | GND | RXD0 | IO34 | RESET Button | Rx | TXD0 | SVN | Tx | GND | 5V | Tx | Rx | Rx | Tx | IO22 | SVP | IO23 | EN | STEP+ | STEP+ | STEP+ | STEP+ | DIR+ | DIR+ | DIR+ | 3V3 | DIR+ | DIR- | STEP- | DIR- | STEP- | DIR- | STEP- | DIR- | STEP- | GREEN | WHITE | 5V | GND | GREEN | WHITE | 5V | GND | GREEN | WHITE | 5V | GND
tValues: 0.1uF | 0.1uF | 0.1uF | 0.1uF | 0.1uF | 0.1uF | DTS | GND | 0.1uF | GND
Notes: Reset | Fedd Hold | Cycle Start | Coolant EN | Reserved | Probe | 3.3V